# Altium project PPC_notebook_electrical_schematics_v0.7.PrjPcb (part 12 of 14)

## Sheet 29 Other Pwr 1.SchDoc
size 420 x 297 mm
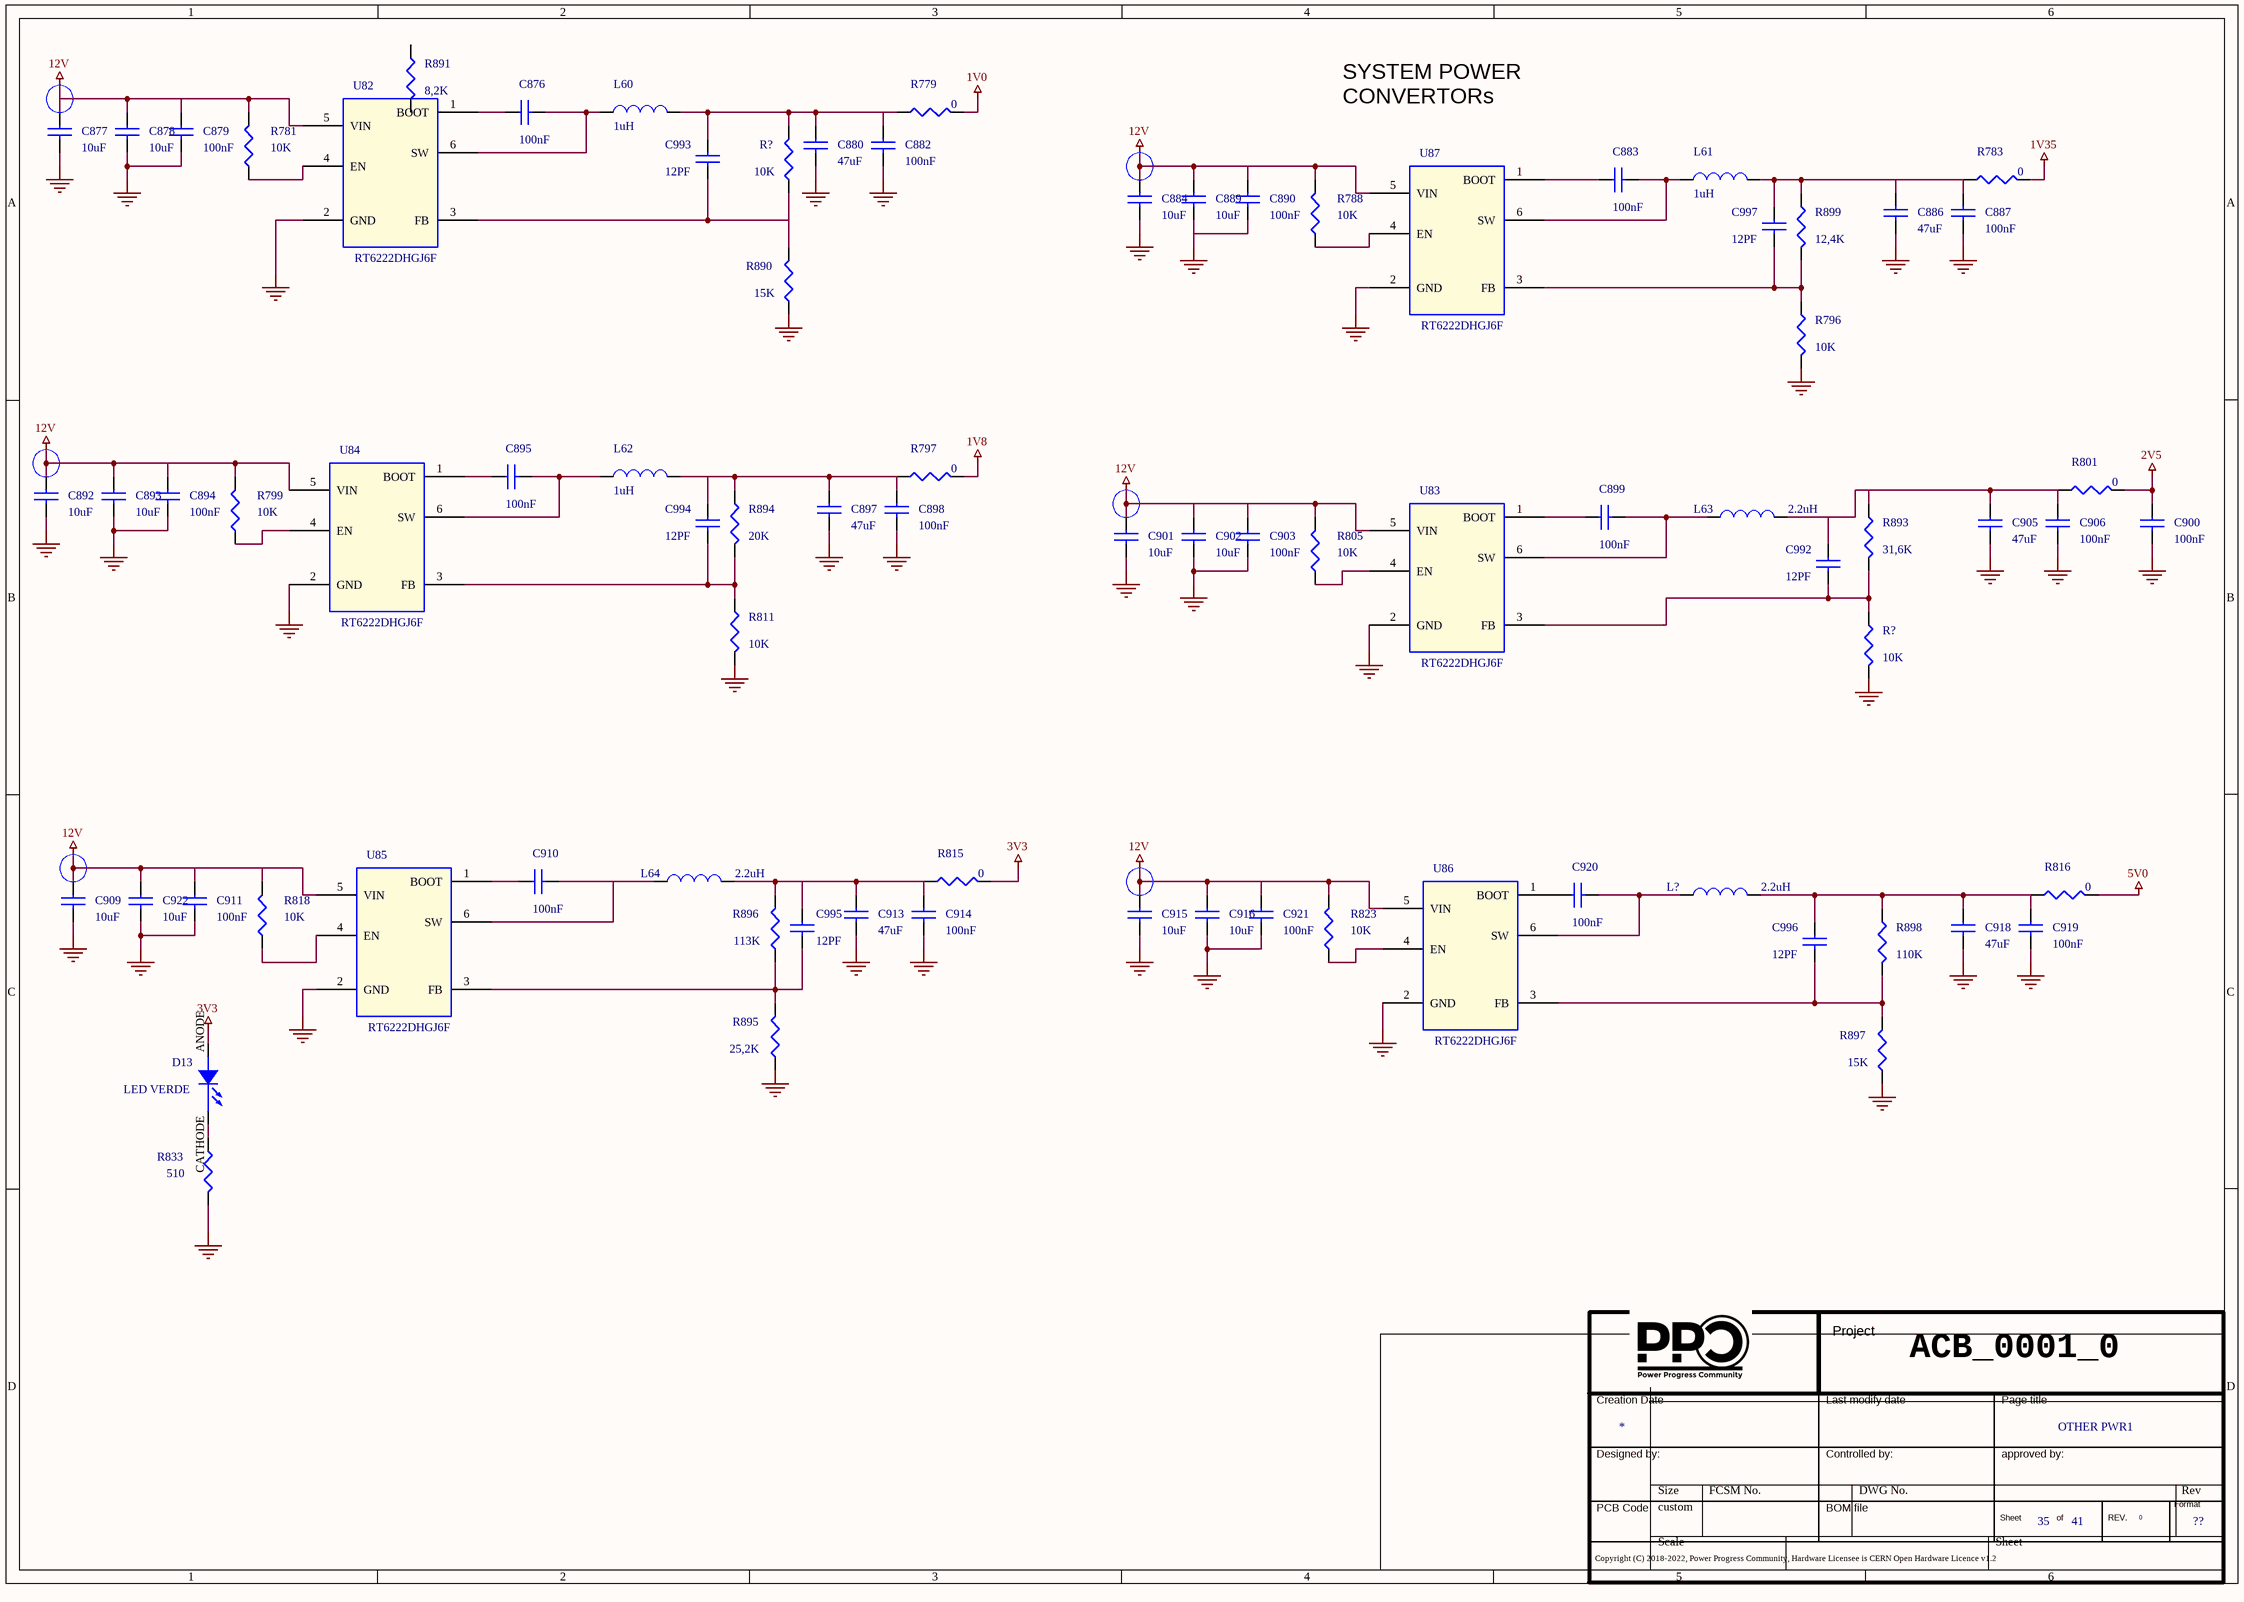
[diagram p61: 29 Other Pwr 1.SchDoc]

### Parts
(Parts that share a designator on the sheet are numbered #1, #2 ... from top to bottom, then left to right.)
*#38  Doc: OTHER PWR1  Page Count: 41  Page Number: 35  Page Size: ??  RevCode: 0  (hidden comment: Title_block_PPC)  (graphical)
C876  100nF  [SMD_0402]
C877  10uF  [SMD_0603]
C878  10uF  [SMD_0603]
C879  100nF  [SMD_0402]
C880  47uF  [SMD_0805]
C882  100nF  [SMD_0402]
C883  100nF  [SMD_0402]
C884  10uF  [SMD_0603]
C886  47uF  [SMD_0805]
C887  100nF  [SMD_0402]
C889  10uF  [SMD_0603]
C890  100nF  [SMD_0402]
C892  10uF  [SMD_0603]
C893  10uF  [SMD_0603]
C894  100nF  [SMD_0402]
C895  100nF  [SMD_0402]
C897  47uF  [SMD_0805]
C898  100nF  [SMD_0402]
C899  100nF  [SMD_0402]
C900  100nF  [SMD_0402]
C901  10uF  [SMD_0603]
C902  10uF  [SMD_0603]
C903  100nF  [SMD_0402]
C905  47uF  [SMD_0805]
C906  100nF  [SMD_0402]
C909  10uF  [SMD_0603]
C910  100nF  [SMD_0402]
C911  100nF  [SMD_0402]
C913  47uF  [SMD_0805]
C914  100nF  [SMD_0402]
C915  10uF  [SMD_0603]
C916  10uF  [SMD_0603]
C918  47uF  [SMD_0805]
C919  100nF  [SMD_0402]
C920  100nF  [SMD_0402]
C921  100nF  [SMD_0402]
C922  10uF  [SMD_0603]
C992  12PF  [SMD_0402]
C993  12PF  [SMD_0402]
C994  12PF  [SMD_0402]
C995  12PF  [SMD_0402]
C996  12PF  [SMD_0402]
C997  12PF  [SMD_0402]
D13  LED VERDE  [led_0603]
L60  1uH  [SMD]
L61  1uH  [SMD]
L62  1uH  [SMD]
L63  2.2uH  [SMD]
L64  2.2uH  [SMD]
L?  2.2uH  [SMD]
R779  0  [SMD_1206]
R781  10K  [SMD_0402]
R783  0  [SMD_1206]
R788  10K  [SMD_0402]
R796  10K  [SMD_0402]
R797  0  [SMD_1206]
R799  10K  [SMD_0402]
R801  0  [SMD_1206]
R805  10K  [SMD_0402]
R811  10K  [SMD_0402]
R815  0  [SMD_1206]
R816  0  [SMD_1206]
R818  10K  [SMD_0402]
R823  10K  [SMD_0402]
R833  510  [SMD_0402]
R890  15K  [SMD_0402]
R891  8,2K  [SMD_0402]
R893  31,6K  [SMD_0402]
R894  20K  [SMD_0402]
R895  25,2K  [SMD_0402]
R896  113K  [SMD_0402]
R897  15K  [SMD_0402]
R898  110K  [SMD_0402]
R899  12,4K  [SMD_0402]
R?#1  10K  [SMD_0402]
R?#2  10K  [SMD_0402]
U82  RT6222DHGJ6F
U83  RT6222DHGJ6F
U84  RT6222DHGJ6F
U85  RT6222DHGJ6F
U86  RT6222DHGJ6F
U87  RT6222DHGJ6F

### Nets
1V0: R779.2
1V8: R797.2
1V35: R783.2
2V5: C900.1 R801.2
3V3: D13.ANODE R815.2
5V0: R816.2
12V: C877.1 C878.1 C879.1 C884.1 C889.1 C890.1 C892.1 C893.1 C894.1 C901.1 C902.1 C903.1 C909.1 C911.1 C915.1 C916.1 C921.1 C922.1 R781.2 R788.2 R799.2 R805.2 R818.2 R823.2 U82.5(VIN) U83.5(VIN) U84.5(VIN) U85.5(VIN) U86.5(VIN) U87.5(VIN)
GND: C877.2 C878.2 C879.2 C880.2 C882.2 C884.2 C886.2 C887.2 C889.2 C890.2 C892.2 C893.2 C894.2 C897.2 C898.2 C900.2 C901.2 C902.2 C903.2 C905.2 C906.2 C909.2 C911.2 C913.2 C914.2 C915.2 C916.2 C918.2 C919.2 C921.2 C922.2 R796.2 R811.2 R833.1 R890.2 R895.2 R897.2 R?#2.2 U82.2(GND) U83.2(GND) U84.2(GND) U85.2(GND) U86.2(GND) U87.2(GND)
NetC876_1: C876.1 U82.1(BOOT)
NetC876_2: C876.2 L60.1 U82.6(SW)
NetC880_1: C880.1 C882.1 C993.1 L60.2 R779.1 R?#1.1
NetC883_1: C883.1 U87.1(BOOT)
NetC883_2: C883.2 L61.1 U87.6(SW)
NetC886_1: C886.1 C887.1 C997.1 L61.2 R783.1 R899.1
NetC895_1: C895.1 U84.1(BOOT)
NetC895_2: C895.2 L62.1 U84.6(SW)
NetC897_1: C897.1 C898.1 C994.1 L62.2 R797.1 R894.1
NetC899_1: C899.1 U83.1(BOOT)
NetC899_2: C899.2 L63.1 U83.6(SW)
NetC905_1: C905.1 C906.1 C992.1 L63.2 R801.1 R893.1
NetC910_1: C910.1 U85.1(BOOT)
NetC910_2: C910.2 L64.1 U85.6(SW)
NetC913_1: C913.1 C914.1 C995.1 L64.2 R815.1 R896.1
NetC918_1: C918.1 C919.1 C996.1 L?.2 R816.1 R898.1
NetC920_1: C920.1 U86.1(BOOT)
NetC920_2: C920.2 L?.1 U86.6(SW)
NetC992_2: C992.2 R893.2 R?#2.1 U83.3(FB)
NetC993_2: C993.2 R890.1 R?#1.2 U82.3(FB)
NetC994_2: C994.2 R811.1 R894.2 U84.3(FB)
NetC995_2: C995.2 R895.1 R896.2 U85.3(FB)
NetC996_2: C996.2 R897.1 R898.2 U86.3(FB)
NetC997_2: C997.2 R796.1 R899.2 U87.3(FB)
NetD13_CATHODE: D13.CATHODE R833.2
NetR781_1: R781.1 U82.4(EN)
NetR788_1: R788.1 U87.4(EN)
NetR799_1: R799.1 U84.4(EN)
NetR805_1: R805.1 U83.4(EN)
NetR818_1: R818.1 U85.4(EN)
NetR823_1: R823.1 U86.4(EN)

Not connected (* = marked no-connect by the designer): R891 1 2

### Notes on the sheet
- SYSTEM POWER
  CONVERTORs
- ACB_0001_0

### Library data of the parts
*#38 = Title_block_PPC: Title: T2080PCIe; Author: MICETEK; Page Create Date: March  8, 1995; Page Title: ?; Page Modify Date: *
C876 C879 C882 C890 C894 C895 C900 C903 C906 C910 C911 C920 C921 = CAP NP_Dup3: COND.CER. 100NF 50V 0402 X7R SMD; Manufacturer Part Number 1: CGA2B3X7R1H104M050BD; Manufacturer 1: TDK; Part Number: PASSIVE_24; RSM: RC0402; PCB Footprint: SMD_0402; Part Type: Capacitors\Ceramic\SMD\0402
C877 C878 C889 C892 C893 C901 C902 C909 C915 C916 C922 = CAP NP_Dup3: COND.CER.10uF 0603 25V SMD; Manufacturer Part Number 1: CL10A106MA8NRNC; Manufacturer 1: SAMSUNG; Part Number: PASSIVE_124; RSM: RC0603; Part Type: Capacitors\Ceramic\SMD\0603; PCB Footprint: SMD_0603
C880 C905 = CAP NP_Dup3: CAP CER 47UF 10V 20% X5R 0805; Manufacturer Part Number 1: JMK212BJ476MG-T; Manufacturer 1: Taiyo Yuden; Part Number: PASSIVE_244; RSM: RC0805; PCB Footprint: SMD_0805; Part Type: Capacitors\Ceramic\SMD\0805
C883 C887 C898 C899 C914 C919 = CAP NP_Dup3: COND.CER. 100NF 50V 0402 X7R SMD; Part Number: PASSIVE_24; Manufacturer 1: TDK; Manufacturer Part Number 1: CGA2B3X7R1H104M050BD; RSM: RC0402; PCB Footprint: SMD_0402; Part Type: Capacitors\Ceramic\SMD\0402
C884 = CAP NP_Dup3: COND.CER.10uF 0603 25V SMD; Part Number: PASSIVE_124; Manufacturer 1: SAMSUNG; Manufacturer Part Number 1: CL10A106MA8NRNC; RSM: RC0603; Part Type: Capacitors\Ceramic\SMD\0603; PCB Footprint: SMD_0603
C886 C897 C913 C918 = CAP NP_Dup3: CAP CER 47UF 10V 20% X5R 0805; Part Number: PASSIVE_244; Manufacturer 1: Taiyo Yuden; Manufacturer Part Number 1: JMK212BJ476MG-T; RSM: RC0805; PCB Footprint: SMD_0805; Part Type: Capacitors\Ceramic\SMD\0805
C992 C993 C996 C997 = CAP NP: COND.CER.12PF 50V 0402 NPO/COG SMD; Manufacturer Part Number 1: GRM1555C1H120JZ01D; Manufacturer 1: MURATA; Part Number: PASSIVE_36; RSM: RC0402; PCB Footprint: SMD_0402; Distributor 1: MURATA ELETTRONICA SPA; Part Type: Capacitors\Ceramic\SMD\0402
C994 C995 = CAP NP: COND.CER.12PF 50V 0402 NPO/COG SMD; Part Number: PASSIVE_36; Manufacturer 1: MURATA; Manufacturer Part Number 1: GRM1555C1H120JZ01D; RSM: RC0402; PCB Footprint: SMD_0402; Part Type: Capacitors\Ceramic\SMD\0402; Distributor 1: MURATA ELETTRONICA SPA
D13 = LED_1: LED CHIPLED VERDE 40mcd 570nm; Manufacturer Part Number 1: 598-8070-107F; Manufacturer 1: DIALIGHT; Part Number: DISCRETE_31; PCB Footprint: SMD_0603; RSM: LED0603-AK; Distributor 1: MOUSER(645-598-8070-107F); Part Type: Diodes\LED; TYPE: LED
L60-L62 = INDUCTOR_Dup1: FIXED IND 1UH 11A 16.5 Mohm SMD; Part Number: PASSIVE_1467; Manufacturer 1: Vishay; Manufacturer Part Number 1: IHLP2525CZER1R0M01; RSM: IND-VISHAY-IHLP2525; PCB Footprint: SMD; Part Type: Inductors\SMD\IHLP2525
L63 L64 = INDUCTOR_Dup1: FIXED IND 2.2UH 7A 16.5 Mohm SMD; Manufacturer Part Number 1: IHLP2525CZER2R2M1; Manufacturer 1: Vishay; Part Number: PASSIVE_513; RSM: IND-VISHAY-IHLP2525; PCB Footprint: SMD; Part Type: Inductors\SMD\IHLP2525
L? = INDUCTOR_Dup1: FIXED IND 2.2UH 7A 16.5 Mohm SMD; Part Number: PASSIVE_513; Manufacturer 1: VISHAY; Manufacturer Part Number 1: IHLP2525CZER2R2M1; PCB Footprint: SMD; Part Type: Inductors\SMD\IHLP2525
R779 R801 = R_Dup6: RESIS. 0R 1/4W 1206 SMD E96; Manufacturer Part Number 1: RC1206JR-070RL; Manufacturer 1: YAGEO; Part Number: PASSIVE_1266; RSM: RC1206; PCB Footprint: SMD_1206; Part Type: Resistors\Fixed\SMD\1206\5%
R781 R788 R796 R799 R805 R811 R818 R823 = R_Dup6: RESIS.CHIP 10K 1% 0402 SMD; Manufacturer 1: ROYAL OHM; Part Number: PASSIVE_584; RSM: RC0402; Manufacturer Part Number 1: RESIS.CHIP 10K 1% 0402 SMD; Part Type: Resistors\Fixed\SMD\0402\1%; PCB Footprint: SMD_0402
R783 R797 R815 R816 = R_Dup6: RESIS. 0R 1/4W 1206 SMD E96; Part Number: PASSIVE_1266; Manufacturer 1: YAGEO; Manufacturer Part Number 1: RC1206JR-070RL; RSM: RC1206; PCB Footprint: SMD_1206; Part Type: Resistors\Fixed\SMD\1206\5%
R833 = R_Dup6: RESIS.CHIP 510R 1% 0402 SMD; Part Number: PASSIVE_749; Manufacturer 1: ROYAL OHM; RSM: RC0402; PCB Footprint: SMD_0402; Part Type: Resistors\Fixed\SMD\0402\1%; Manufacturer Part Number 1: RESIS.CHIP 510R 1% 0402 SMD
R890 R897 = R: RESIS.CHIP 15K 1% 0402 SMD; Manufacturer 1: ROYAL OHM; Part Number: PASSIVE_614; PCB Footprint: SMD_0402; Distributor 1: CAMEL ELETTRONICA SRL  #; Manufacturer Part Number 1: RESIS.CHIP 15K 1% 0402 SMD; Part Type: Resistors\Fixed\SMD\0402\1%
R891 = R: RESIS. CHIP 8,2K 1% 0402 SMD; Manufacturer Part Number 1: RMC1/16SK8201FTH; Manufacturer 1: KAMAYA; Part Number: PASSIVE_786; RSM: RC0402; PCB Footprint: SMD_0402; Distributor 1: MODULI ELETTRONICI E COMPONENTI spa; Part Type: Resistors\Fixed\SMD\0402\1%
R893 = R: RESIS.CHIP 31K6 1% 0402 SMD; Part Number: PASSIVE_691; Manufacturer 1: ROYAL OHM; Manufacturer Part Number 1: RESIS.CHIP6K34 1% 0402 SMD; PCB Footprint: SMD_0402; Part Type: Resistors\Fixed\SMD\0402\1%; Distributor 1: CAMEL ELETTRONICA SRL  #
R894 = R: RESIS.CHIP 20K 1% 0402 SMD; Part Number: PASSIVE_641; Manufacturer 1: YAGEO; Manufacturer Part Number 1: RC0402FR-1320KL; PCB Footprint: SMD_0402; Part Type: Resistors\Fixed\SMD\0402\1%; Distributor 1: MOUSER(603-RC0402FR-1320KL)
R895 = R: RESIS.CHIP 25K2 1% 0402 SMD; Manufacturer 1: ROYAL OHM; Part Number: PASSIVE_657; PCB Footprint: SMD_0402; Distributor 1: CAMEL ELETTRONICA SRL  #; Manufacturer Part Number 1: RESIS.CHIP25K2 1% 0402 SMD; Part Type: Resistors\Fixed\SMD\0402\1%
R896 = R: RES 113K OHM 1/10W 1% 0402 SMD; Manufacturer Part Number 1: ERJ-2RKF1133X; Manufacturer 1: PANASONIC; Part Number: PASSIVE_1395; PCB Footprint: SMD_0402; Distributor 1: DIGIKEY(P113KLTR-ND); Part Type: Resistors\Fixed\SMD\0402\1%
R898 = R: RESIS.CHIP 110K 1% 0402 SMD; Manufacturer 1: ROYAL OHM; Part Number: PASSIVE_588; PCB Footprint: SMD_0402; Distributor 1: CAMEL ELETTRONICA SRL  #; Manufacturer Part Number 1: RESIS.CHIP 110K 1% 0402 SMD; Part Type: Resistors\Fixed\SMD\0402\1%
R899 = R: RESIS.CHIP 12,4K 1% 0402 SMD; Part Number: PASSIVE_591; Manufacturer 1: ROYAL OHM; PCB Footprint: SMD_0402; Part Type: Resistors\Fixed\SMD\0402\1%; Manufacturer Part Number 1: RESIS.CHIP 12,4K 1% 0402 SMD; Distributor 1: CAMEL ELETTRONICA SRL  #
R?#1 = R_Dup6: RESIS.CHIP 10K 1% 0402 SMD; Part Number: PASSIVE_584; Manufacturer 1: ROYAL OHM; PCB Footprint: SMD_0402; Part Type: Resistors\Fixed\SMD\0402\1%; Manufacturer Part Number 1: RESIS.CHIP 10K 1% 0402 SMD
R?#2 = R_Dup6: RESIS.CHIP 10K 1% 0402 SMD; Manufacturer 1: ROYAL OHM; Part Number: PASSIVE_584; PCB Footprint: SMD_0402; Manufacturer Part Number 1: RESIS.CHIP 10K 1% 0402 SMD; Part Type: Resistors\Fixed\SMD\0402\1%

## Sheet 30A Other Pwr 2.SchDoc
size 297 x 209 mm
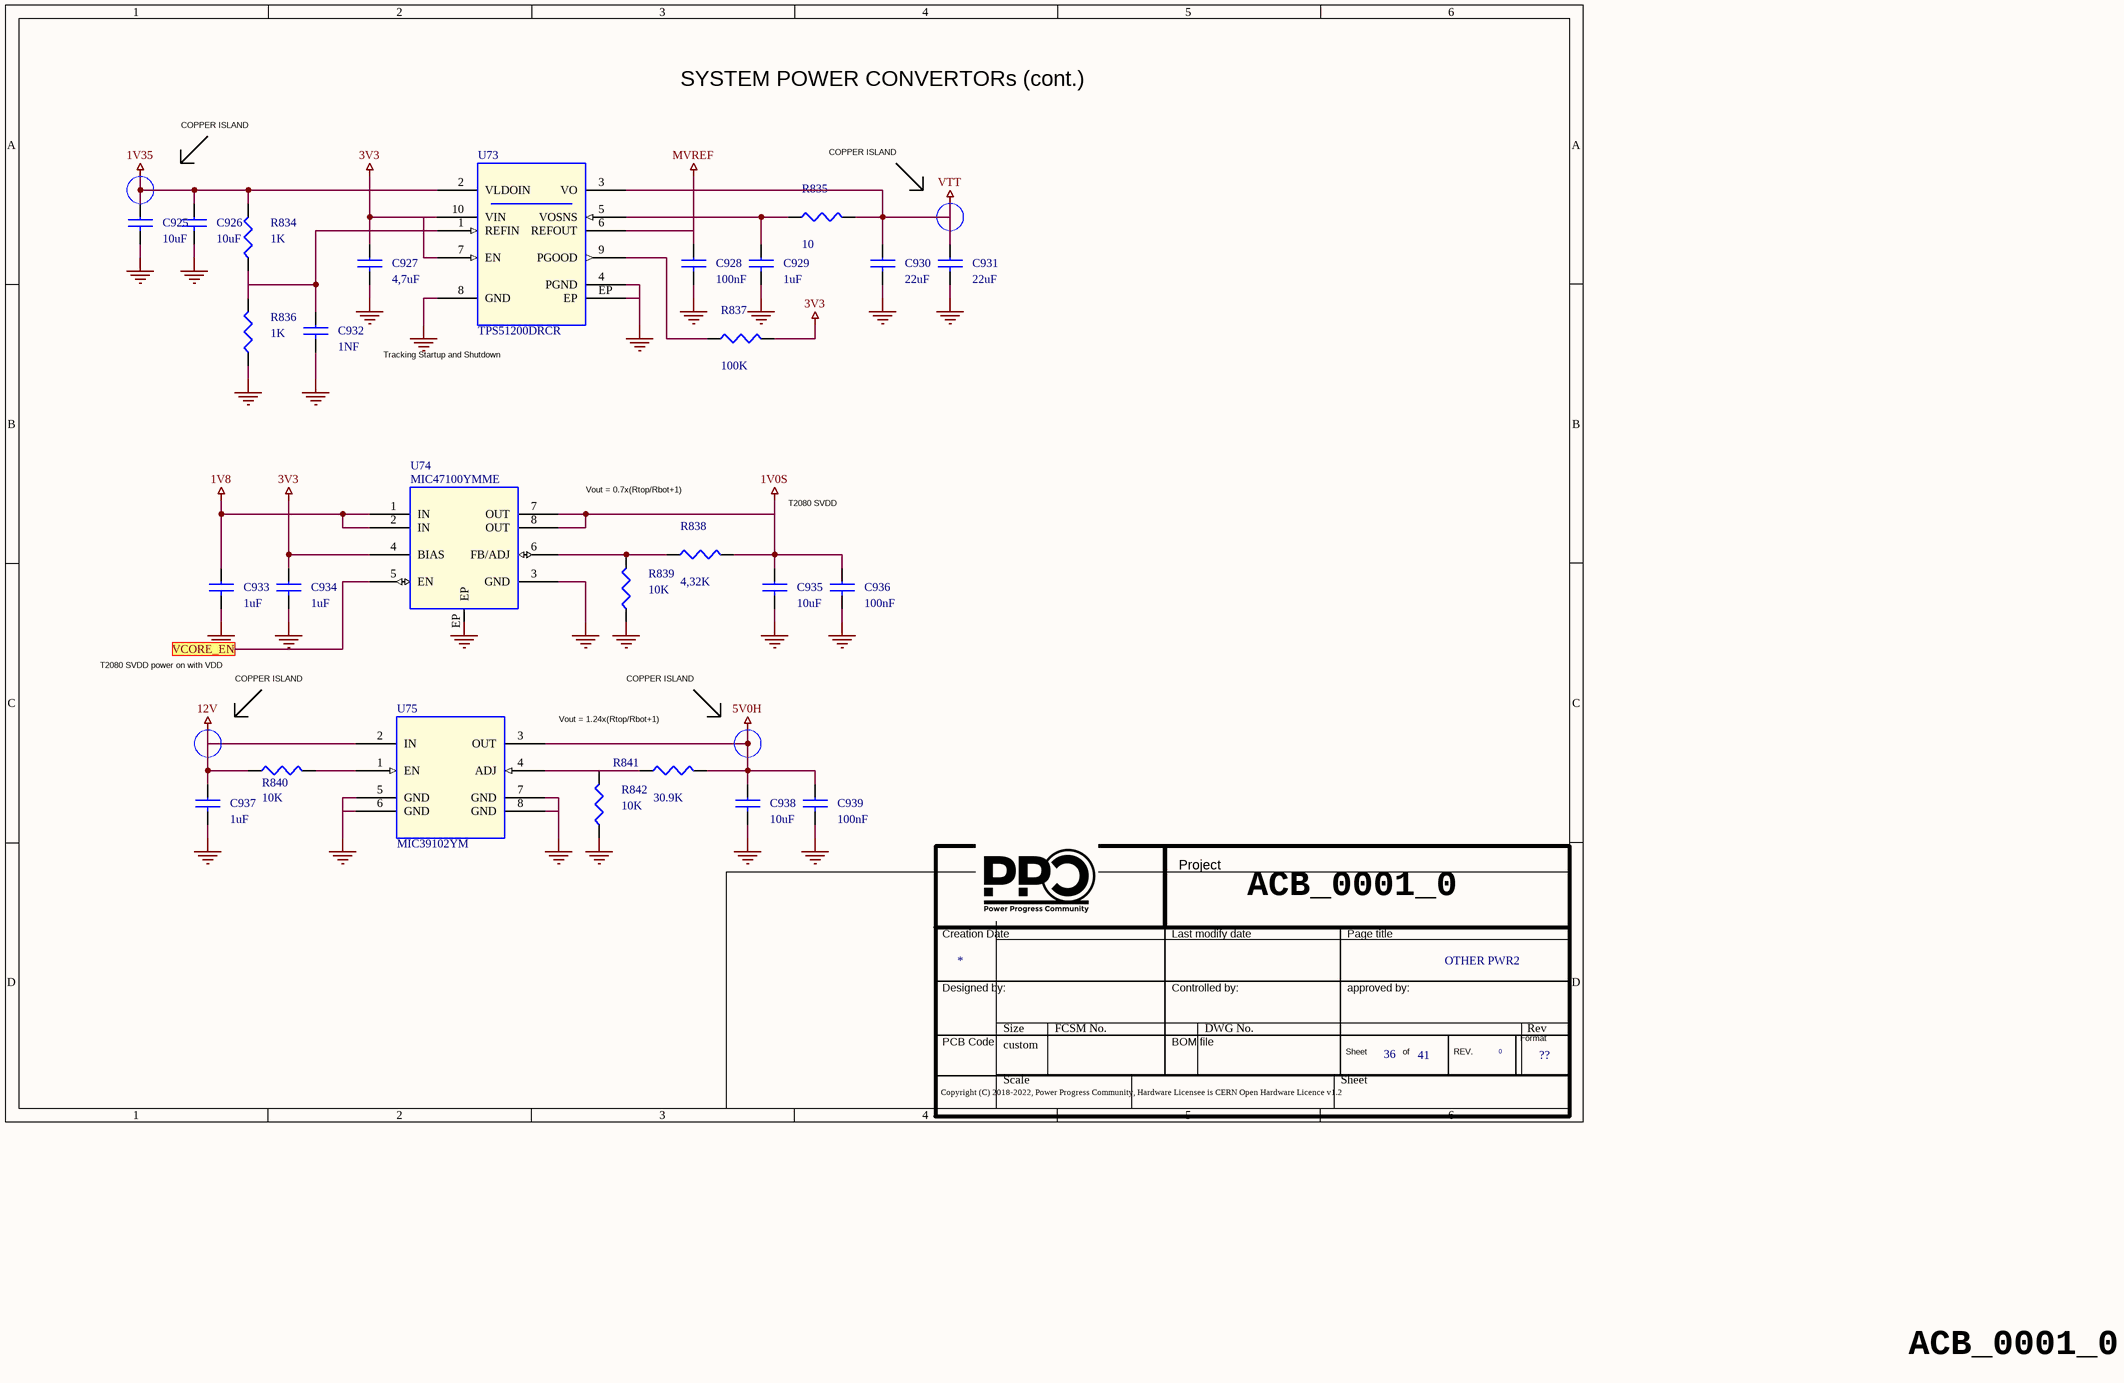
[diagram p62: 30A Other Pwr 2.SchDoc]

### Parts
(Parts that share a designator on the sheet are numbered #1, #2 ... from top to bottom, then left to right.)
*#39  Doc: OTHER PWR2  Page Count: 41  Page Number: 36  Page Size: ??  RevCode: 0  (hidden comment: Title_block_PPC)  (graphical)
C925  10uF  [SMD_0603]
C926  10uF  [SMD_0603]
C927  4,7uF  [SMD_0603]
C928  100nF  [SMD_0402]
C929  1uF  [SMD_0402]
C930  22uF  [SMD_0805]
C931  22uF  [SMD_0805]
C932  1NF  [SMD_0402]
C933  1uF  [SMD_0402]
C934  1uF  [SMD_0402]
C935  10uF  [SMD_0603]
C936  100nF  [SMD_0402]
C937  1uF  [SMD_0402]
C938  10uF  [SMD_0603]
C939  100nF  [SMD_0402]
R834  1K  [SMD_0402]
R835  10  [SMD_0402]
R836  1K  [SMD_0402]
R837  100K  [SMD_0402]
R838  4,32K  [SMD_0402]
R839  10K  [SMD_0402]
R840  10K  [SMD_0402]
R841  30.9K  [SMD_0402]
R842  10K  [SMD_0402]
U73  TPS51200DRCR  [QFN-10]
U74  MIC47100YMME  [msop_8]
U75  MIC39102YM  [SOIC-8]

### Ports
VCORE_EN

### Nets
1V0S: C935.1 C936.1 R838.2 U74.7(OUT) U74.8(OUT)
1V8: C933.1 U74.1(IN) U74.2(IN)
1V35: C925.1 C926.1 R834.2 U73.2(VLDOIN)
3V3: C927.1 C934.1 R837.2 U73.7(EN) U73.10(VIN) U74.4(BIAS)
5V0H: C938.1 C939.1 R841.2 U75.3(OUT)
12V: C937.1 R840.1 U75.2(IN)
GND: C925.2 C926.2 C927.2 C928.2 C929.2 C930.2 C931.2 C932.2 C933.2 C934.2 C935.2 C936.2 C937.2 C938.2 C939.2 R836.1 R839.1 R842.1 U73.4(PGND) U73.8(GND) U73.EP U74.3(GND) U74.EP U75.5(GND) U75.6(GND) U75.7(GND) U75.8(GND)
MVREF: C928.1 U73.6(REFOUT)
VTT: C930.1 C931.1 R835.2 U73.3(VO)
NetC929_1: C929.1 R835.1 U73.5(VOSNS)
NetC932_1: C932.1 R834.1 R836.2 U73.1(REFIN)
NetR292_2: U74.5(EN) ; port VCORE_EN
NetR837_1: R837.1 U73.9(PGOOD)
NetR838_1: R838.1 R839.2 U74.6(FB/ADJ)
NetR840_2: R840.2 U75.1(EN)
NetR841_1: R841.1 R842.2 U75.4(ADJ)

### Notes on the sheet
- COPPER ISLAND
- SYSTEM POWER CONVERTORs (cont.)
- Tracking Startup and Shutdown
- Vout = 0.7x(Rtop/Rbot+1)
- T2080 SVDD
- T2080 SVDD power on with VDD
- Vout = 1.24x(Rtop/Rbot+1)
- ACB_0001_0

### Library data of the parts
*#39 = Title_block_PPC: Title: T2080PCIe; Author: MICETEK; Page Create Date: March  8, 1995; Page Title: ?; Page Modify Date: *
C925 C926 C935 C938 = CAP NP_Dup3: as C877 on sheet 29 Other Pwr 1; PCB Footprint: SMD_0603; Part Type: Capacitors\Ceramic\SMD\0603
C927 = CAP NP_Dup3: COND.CER.4,7uF 16V X5R 0603 SMD; Part Number: PASSIVE_1405; Manufacturer 1: SAMSUNG; Manufacturer Part Number 1: CL10A475KO8NNNC; RSM: RC0603; Part Type: Capacitors\Ceramic\SMD\0603; PCB Footprint: SMD_0603
C928 C936 = CAP NP_Dup3: as C883 on sheet 29 Other Pwr 1; Part Type: Capacitors\Ceramic\SMD\0402; PCB Footprint: SMD_0402
C929 C933 C934 C937 = CAP NP_Dup3: CAP CER 1UF 25V X6S 0402; Manufacturer Part Number 1: GRM155C81E105KE11D; Manufacturer 1: Murata; Part Number: PASSIVE_1446; RSM: RC0402; PCB Footprint: SMD_0402; Part Type: Capacitors\Ceramic\SMD\0402
C930 C931 = CAP NP_Dup3: 22UF 35V 20% 0805; Manufacturer Part Number 1: C2012X5R1V226M125AC; Manufacturer 1: TDK; Part Number: PASSIVE_224; RSM: RC0805; PCB Footprint: SMD_0805; Part Type: Capacitors\Ceramic\SMD\0805
C932 = CAP NP_Dup3: COND.CER. 1NF 50V 0402 X7R SMD; Part Number: PASSIVE_47; Manufacturer 1: Murata; Manufacturer Part Number 1: GRM15XR71H102KA86D; RSM: RC0402; Part Type: Capacitors\Ceramic\SMD\0402; PCB Footprint: SMD_0402
C939 = CAP NP_Dup3: as C876 on sheet 29 Other Pwr 1; PCB Footprint: SMD_0402; Part Type: Capacitors\Ceramic\SMD\0402
R834 R836 = R_Dup6: RESIS.CHIP 1K 1% 0402 SMD; Part Number: PASSIVE_628; Manufacturer 1: ROYAL OHM; RSM: RC0402; PCB Footprint: SMD_0402; Part Type: Resistors\Fixed\SMD\0402\1%; Manufacturer Part Number 1: RESIS.CHIP 1K 1% 0402 SMD
R835 = R_Dup6: RESIS.CHIP 10R 5% 0402 SMD; Manufacturer 1: ROYAL OHM; Part Number: PASSIVE_811; RSM: RC0402; PCB Footprint: SMD_0402; Manufacturer Part Number 1: RESIS.CHIP 10R 5% 0402 SMD; Part Type: Resistors\Fixed\SMD\0402\5%
R837 = R_Dup6: RESIS.CHIP 100K 5% 0402 SMD; Part Number: PASSIVE_813; Manufacturer 1: ROYAL OHM; RSM: RC0402; Part Type: Resistors\Fixed\SMD\0402\5%; Manufacturer Part Number 1: RESIS.CHIP 100K 5% 0402 SMD; PCB Footprint: SMD_0402
R838 = R_Dup6: RESIS.CHIP 4,32K 0402 1% SMD; Manufacturer Part Number 1: ERJ-2RKF4321X; Manufacturer 1: PANASONIC; Part Number: PASSIVE_716; RSM: RC0402; PCB Footprint: SMD_0402; Part Type: Resistors\Fixed\SMD\0402\1%
R839 R842 = R_Dup6: RESIS.CHIP 10K 1% 0402 SMD; Part Number: PASSIVE_584; Manufacturer 1: ROYAL OHM; RSM: RC0402; Part Type: Resistors\Fixed\SMD\0402\1%; Manufacturer Part Number 1: RESIS.CHIP 10K 1% 0402 SMD; PCB Footprint: SMD_0402
R840 = R_Dup6: as R781 on sheet 29 Other Pwr 1; Manufacturer Part Number 1: RESIS.CHIP 10K 1% 0402 SMD; Part Type: Resistors\Fixed\SMD\0402\1%; PCB Footprint: SMD_0402
R841 = R_Dup6: RESIS.CHIP 30.9K 1% 0402 SMD; Manufacturer Part Number 1: ERJ-1GNF3092C; Manufacturer 1: bourns; Part Number: PASSIVE_1452; RSM: RC0402; PCB Footprint: SMD_0402; Part Type: Resistors\Fixed\SMD\0402\1%
U73 = TPS51200_1: IC CONV DDR DDR2 DDR3 10SON; Manufacturer 1: TEXAS; Part Number: LINEAR_222; MPN: TPS51200DRCT; Vendor: TI; RSM: VSON-10-3_1x3_1; PCB Footprint: SON10; Distributor 1: DIGIKEY (296-26978-1-ND); Manufacturer Part Number 1: TPS51200DRCR; Part Type: Regulators\Switching; TYPE: IC
U74 = MIC47100-MSOP8_1: LDO 1A High Speed, Low Vin LDO; Manufacturer 1: MICROCHIP; Part Number: LINEAR_328; MPN: MIC49150YMM; PCB Footprint: MSOP8; Vendor: Micrel; RSM: MSOP-8-EP; Distributor 1: MOUSER(998-MIC47100YMME); Manufacturer Part Number 1: MIC47100YMME; Part Type: Regulators\LDO; TYPE: IC
U75 = MIC39102-SOIC: LDO 1.0A 1.0% Fixed Voltage LDO; Manufacturer 1: MICROCHIP; Part Number: LINEAR_329; PCB Footprint: SOIC8; Vendor: Micrel; RSM: SO-8; Distributor 1: MOUSER(998-MIC39102YM); Manufacturer Part Number 1: MIC39102YM; Part Type: Regulators\LDO; TYPE: IC; MPN: MIC39102YM

## Sheet 30B Main Power.SchDoc
size 420 x 297 mm
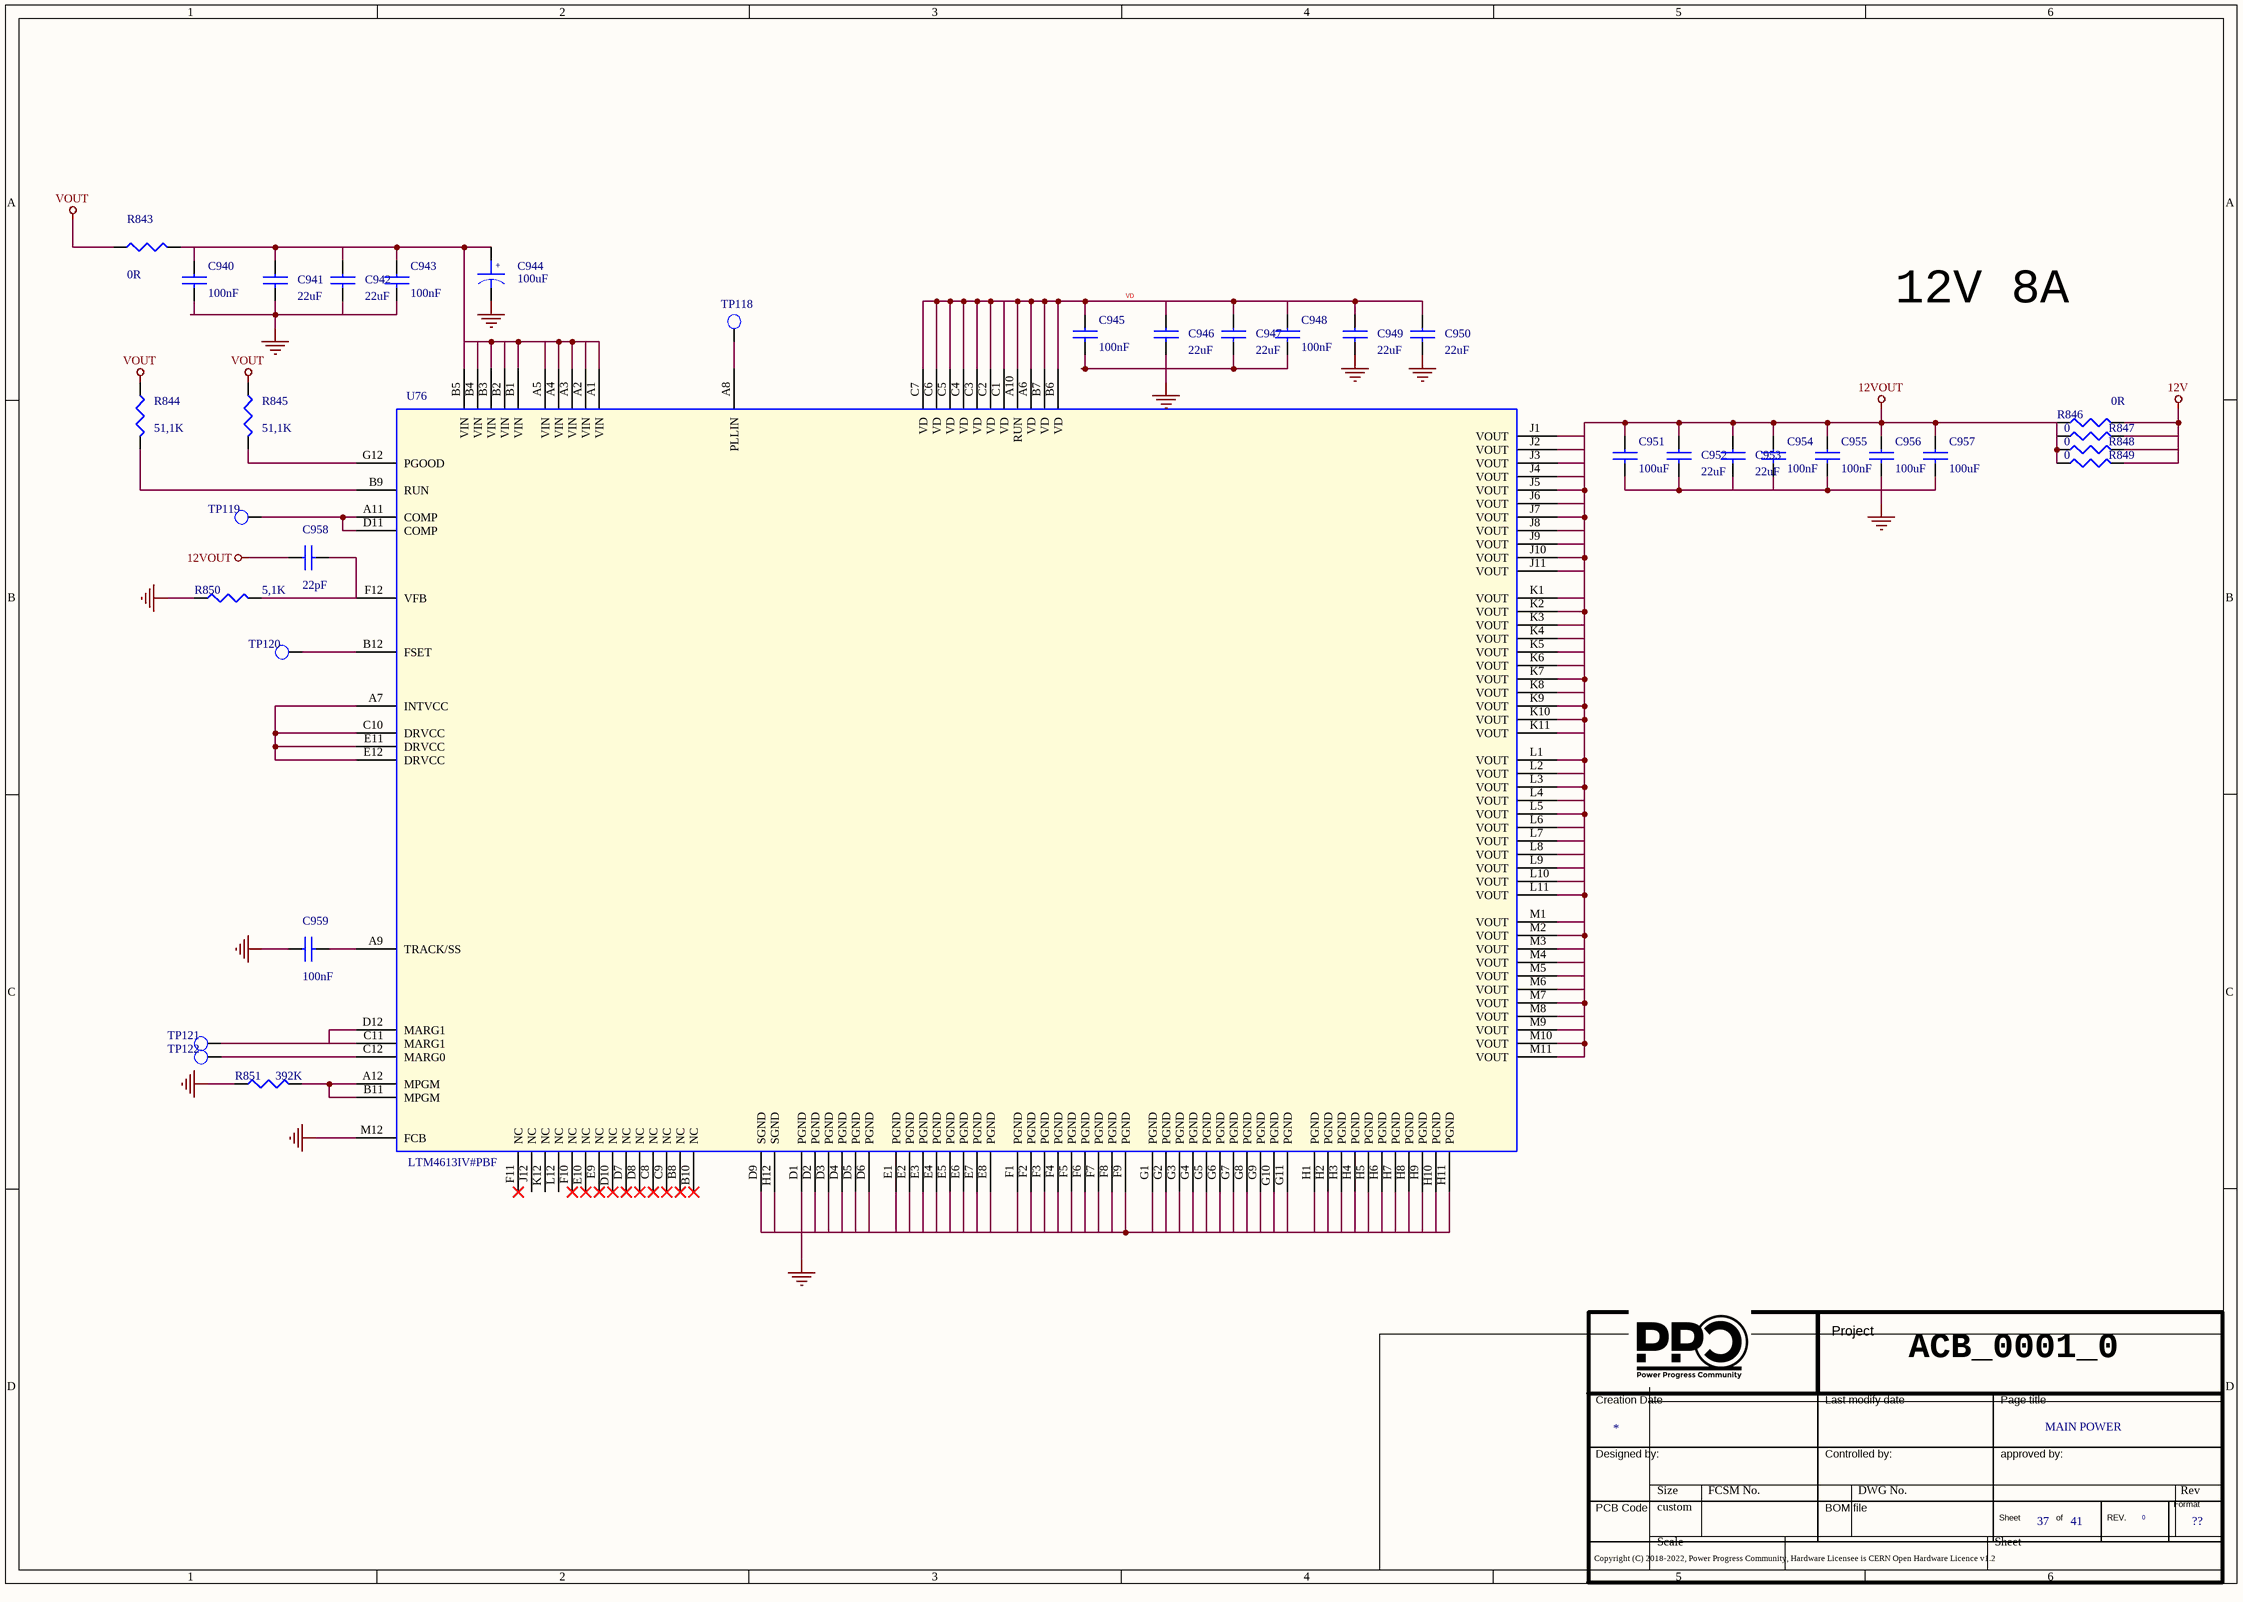
[diagram p63: 30B Main Power.SchDoc]

### Parts
(Parts that share a designator on the sheet are numbered #1, #2 ... from top to bottom, then left to right.)
*#40  Doc: MAIN POWER  Page Count: 41  Page Number: 37  Page Size: ??  RevCode: 0  (hidden comment: Title_block_PPC)  (graphical)
C940  100nF  [SMD_0402]
C941  22uF  [SMD_0805]
C942  22uF  [SMD_0805]
C943  100nF  [SMD_0402]
C944  100uF  [SMD_6.3X6.3x6.1]
C945  100nF  [SMD_0402]
C946  22uF  [SMD_0805]
C947  22uF  [SMD_0805]
C948  100nF  [SMD_0402]
C949  22uF  [SMD_0805]
C950  22uF  [SMD_0805]
C951  100uF  [SMD_1210]
C952  22uF  [SMD_0805]
C953  22uF  [SMD_0805]
C954  100nF  [SMD_0402]
C955  100nF  [SMD_0402]
C956  100uF  [SMD_1210]
C957  100uF  [SMD_1210]
C958  22pF  [SMD_0402]
C959  100nF  [SMD_0402]
R843  0R  [SMD_2512]
R844  51,1K  [SMD_0402]
R845  51,1K  [SMD_0402]
R846  0R  [SMD_2512]
R847  0  [SMD_1206]
R848  0  [SMD_1206]
R849  0  [SMD_1206]
R850  5,1K  [SMD_0402]
R851  392K  [SMD_0402]
TP118  TEST POINT  [PCB]  (value not drawn)
TP119  TEST POINT  [PCB]  (value not drawn)
TP120  TEST POINT  [PCB]  (value not drawn)
TP121  TEST POINT  [PCB]  (value not drawn)
TP122  TEST POINT  [PCB]  (value not drawn)
U76  LTM4613IV#PBF  [LGA-133]

### Nets
12V: R846.2 R847.1 R848.1 R849.1
12VOUT: C951.1 C952.1 C953.1 C954.1 C955.1 C956.1 C957.1 C958.1 R846.1 R847.2 R848.2 R849.2 U76.J1(VOUT) U76.J2(VOUT) U76.J3(VOUT) U76.J4(VOUT) U76.J5(VOUT) U76.J6(VOUT) U76.J7(VOUT) U76.J8(VOUT) U76.J9(VOUT) U76.J10(VOUT) U76.J11(VOUT) U76.K1(VOUT) U76.K2(VOUT) U76.K3(VOUT) U76.K4(VOUT) U76.K5(VOUT) U76.K6(VOUT) U76.K7(VOUT) U76.K8(VOUT) U76.K9(VOUT) U76.K10(VOUT) U76.K11(VOUT) U76.L1(VOUT) U76.L2(VOUT) U76.L3(VOUT) U76.L4(VOUT) U76.L5(VOUT) U76.L6(VOUT) U76.L7(VOUT) U76.L8(VOUT) U76.L9(VOUT) U76.L10(VOUT) U76.L11(VOUT) U76.M1(VOUT) U76.M2(VOUT) U76.M3(VOUT) U76.M4(VOUT) U76.M5(VOUT) U76.M6(VOUT) U76.M7(VOUT) U76.M8(VOUT) U76.M9(VOUT) U76.M10(VOUT) U76.M11(VOUT)
GND: C940.2 C941.2 C942.2 C943.2 C944.2 C945.2 C946.2 C947.2 C948.2 C949.2 C950.2 C956.2 C959.1 R850.1 R851.1 U76.D1(PGND) U76.D2(PGND) U76.D3(PGND) U76.D4(PGND) U76.D5(PGND) U76.D6(PGND) U76.D9(SGND) U76.E1(PGND) U76.E2(PGND) U76.E3(PGND) U76.E4(PGND) U76.E5(PGND) U76.E6(PGND) U76.E7(PGND) U76.E8(PGND) U76.F1(PGND) U76.F2(PGND) U76.F3(PGND) U76.F4(PGND) U76.F5(PGND) U76.F6(PGND) U76.F7(PGND) U76.F8(PGND) U76.F9(PGND) U76.G1(PGND) U76.G2(PGND) U76.G3(PGND) U76.G4(PGND) U76.G5(PGND) U76.G6(PGND) U76.G7(PGND) U76.G8(PGND) U76.G9(PGND) U76.G10(PGND) U76.G11(PGND) U76.H1(PGND) U76.H2(PGND) U76.H3(PGND) U76.H4(PGND) U76.H5(PGND) U76.H6(PGND) U76.H7(PGND) U76.H8(PGND) U76.H9(PGND) U76.H10(PGND) U76.H11(PGND) U76.H12(SGND) U76.M12(FCB)
VOUT: R843.1 R844.1 R845.1
VD: C945.1 C946.1 C947.1 C948.1 C949.1 C950.1 U76.A6(VD) U76.A10(RUN) U76.B6(VD) U76.B7(VD) U76.C1(VD) U76.C2(VD) U76.C3(VD) U76.C4(VD) U76.C5(VD) U76.C6(VD) U76.C7(VD)
NetC940_1: C940.1 C941.1 C942.1 C943.1 C944.1 R843.2 U76.A1(VIN) U76.A2(VIN) U76.A3(VIN) U76.A4(VIN) U76.A5(VIN) U76.B1(VIN) U76.B2(VIN) U76.B3(VIN) U76.B4(VIN) U76.B5(VIN)
NetC951_2: C951.2 C952.2 C953.2 C954.2 C955.2 C957.2
NetC958_2: C958.2 R850.2 U76.F12(VFB)
NetC959_2: C959.2 U76.A9(TRACK/SS)
NetR844_2: R844.2 U76.B9(RUN)
NetR845_2: R845.2 U76.G12(PGOOD)
NetR851_2: R851.2 U76.A12(MPGM) U76.B11(MPGM)
NetTP118_1: TP118.1(TP) U76.A8(PLLIN)
NetTP119_1: TP119.1(TP) U76.A11(COMP) U76.D11(COMP)
NetTP120_1: TP120.1(TP) U76.B12(FSET)
NetTP121_1: TP121.1(TP) U76.C11(MARG1) U76.D12(MARG1)
NetTP122_1: TP122.1(TP) U76.C12(MARG0)
NetU76_A7: U76.A7(INTVCC) U76.C10(DRVCC) U76.E11(DRVCC) U76.E12(DRVCC)

Not connected (* = marked no-connect by the designer): U76 B8(NC)* B10(NC)* C8(NC)* C9(NC)* D7(NC)* D8(NC)* D10(NC)* E9(NC)* E10(NC)* F10(NC)* F11(NC)* J12(NC) K12(NC) L12(NC)

### Notes on the sheet
- 12V 8A
- ACB_0001_0
- (in symbol CAP POL) +

### Library data of the parts
*#40 = Title_block_PPC: Title: PORTATILE ACUBE; Author: MICETEK; Page Create Date: March  8, 1995; Page Title: ?; Page Modify Date: *
C940 C943 C945 C948 = CAP NP_Dup10: COND.CER. 100NF 50V 0402 X7R SMD; Manufacturer Part Number 1: CGA2B3X7R1H104M050BD; Manufacturer 1: TDK; Part Number: PASSIVE_24; RSM: RC0402; PCB Footprint: SMD_0402; Distributor 1: DIGKEY (445-9694-2-ND); Part Type: Capacitors\Ceramic\SMD\0402
C941 C942 C946 C947 C949 C950 C952 C953 = CAP NP_Dup3: 22UF 35V 20% 0805; Part Number: PASSIVE_224; Manufacturer 1: TDK; Manufacturer Part Number 1: C2012X5R1V226M125AC; RSM: RC0805; Part Type: Capacitors\Ceramic\SMD\0805; PCB Footprint: SMD_0805
C944 = CAP POL: CAP ALUM 100UF 35V 20% SMD; Part Number: PASSIVE_1410; Manufacturer 1: PANASONIC; Manufacturer Part Number 1: EEE-FT1V101AP; RSM: CE-6_3X6_3; PCB Footprint: SMD_6.3X6.3x6.1; Part Type: Capacitors\Aluminium\SMD
C951 = CAP NP_Dup10: CAP CER 100UF 16V 20% X5R 1210; Part Number: PASSIVE_264; Manufacturer 1: Taiyo Yuden; Manufacturer Part Number 1: EMK325ABJ107MM-T; RSM: RC1210; PCB Footprint: SMD_1210; Part Type: Capacitors\Ceramic\SMD\1210; Distributor 1: DIGIKEY (587-3152-2-ND)
C954 C955 = CAP NP_Dup10: COND.CER. 100NF 50V 0402 X7R SMD; Part Number: PASSIVE_24; Manufacturer 1: TDK; Manufacturer Part Number 1: CGA2B3X7R1H104M050BD; RSM: RC0402; PCB Footprint: SMD_0402; Part Type: Capacitors\Ceramic\SMD\0402; Distributor 1: DIGKEY (445-9694-2-ND)
C956 C957 = CAP NP_Dup3: CAP CER 100UF 16V 20% X5R 1210; Manufacturer Part Number 1: EMK325ABJ107MM-T; Manufacturer 1: Taiyo Yuden; Part Number: PASSIVE_264; RSM: RC1210; PCB Footprint: SMD_1210; Part Type: Capacitors\Ceramic\SMD\1210
C958 = CAP NP_Dup3: COND.CER. 22PF 50V 0402 NPO 5% SMD; Manufacturer Part Number 1: GRM1555C1H220JZ01; Manufacturer 1: Murata; Part Number: PASSIVE_65; RSM: RC0402; PCB Footprint: SMD_0402; Part Type: Capacitors\Ceramic\SMD\0402
C959 = CAP NP_Dup3: as C876 on sheet 29 Other Pwr 1; PCB Footprint: SMD_0402; Part Type: Capacitors\Ceramic\SMD\0402
R843 R846 = R_Dup9: Thick Film Resistors 0OHM 1WATT 5%; Manufacturer Part Number 1: CR2512-J/-000ELF; Manufacturer 1: bourns; Part Number: PASSIVE_1318; RSM: RC2512; PCB Footprint: SMD_2512; Distributor 1: MOUSER(652-CR2512-J/-000ELF); Part Type: Resistors\Fixed\SMD\2512\1%
R844 R845 = R_Dup6: RESIS.CHIP 51K1 1% 0402 SMD; Part Number: PASSIVE_748; Manufacturer 1: ROYAL OHM; Manufacturer Part Number 1: CAMEL ELETTRONICA SRL  #; RSM: RC0402; PCB Footprint: SMD_0402; Part Type: Resistors\Fixed\SMD\0402\1%
R847-R849 = R_Dup6: RESIS. 0R 1/4W 1206 SMD E96; Manufacturer Part Number 1: CR32000ZL; Manufacturer 1: ASJ; Part Number: PASSIVE_1266; RSM: RC1206; PCB Footprint: SMD_1206; Part Type: Resistors\Fixed\SMD\1206\5%
R850 = R_Dup6: RES SMD 5.1K OHM 1% 1/16W 0402; Part Number: PASSIVE_742; Manufacturer 1: YAGEO; Manufacturer Part Number 1: RC0402FR-075K1L; RSM: RC0402; PCB Footprint: SMD_0402; Part Type: Resistors\Fixed\SMD\0402\1%
R851 = R_Dup6: RES 392K OHM 1/10W 1% 0402 SMD; Manufacturer Part Number 1: CRCW0402392KFKED; Manufacturer 1: Vishay; Part Number: PASSIVE_713; RSM: RC0402; PCB Footprint: SMD_0402; Part Type: Resistors\Fixed\SMD\0402\1%
TP118-TP122 = T POINT R: TEST POINT SU PCB; Part Number: CONNECTORS_542; RSM: AE-TESTPOINT; PCB Footprint: PCB; Part Type: Tpoint
U76 = LTM4613: Ultralow EMI, 36V, 8A Step-down Module; Manufacturer 1: ANALOG; Part Number: LINEAR_324; RSM: LGA-133-15X15; Distributor 1: MOUSER(584-LTM4613IV#PBF); Manufacturer Part Number 1: LTM4613IV#PBF; Part Type: Regulators\MODULE; PCB Footprint: LGA-133

## Sheet 30C_battery_Charger.SchDoc
size 508 x 355 mm
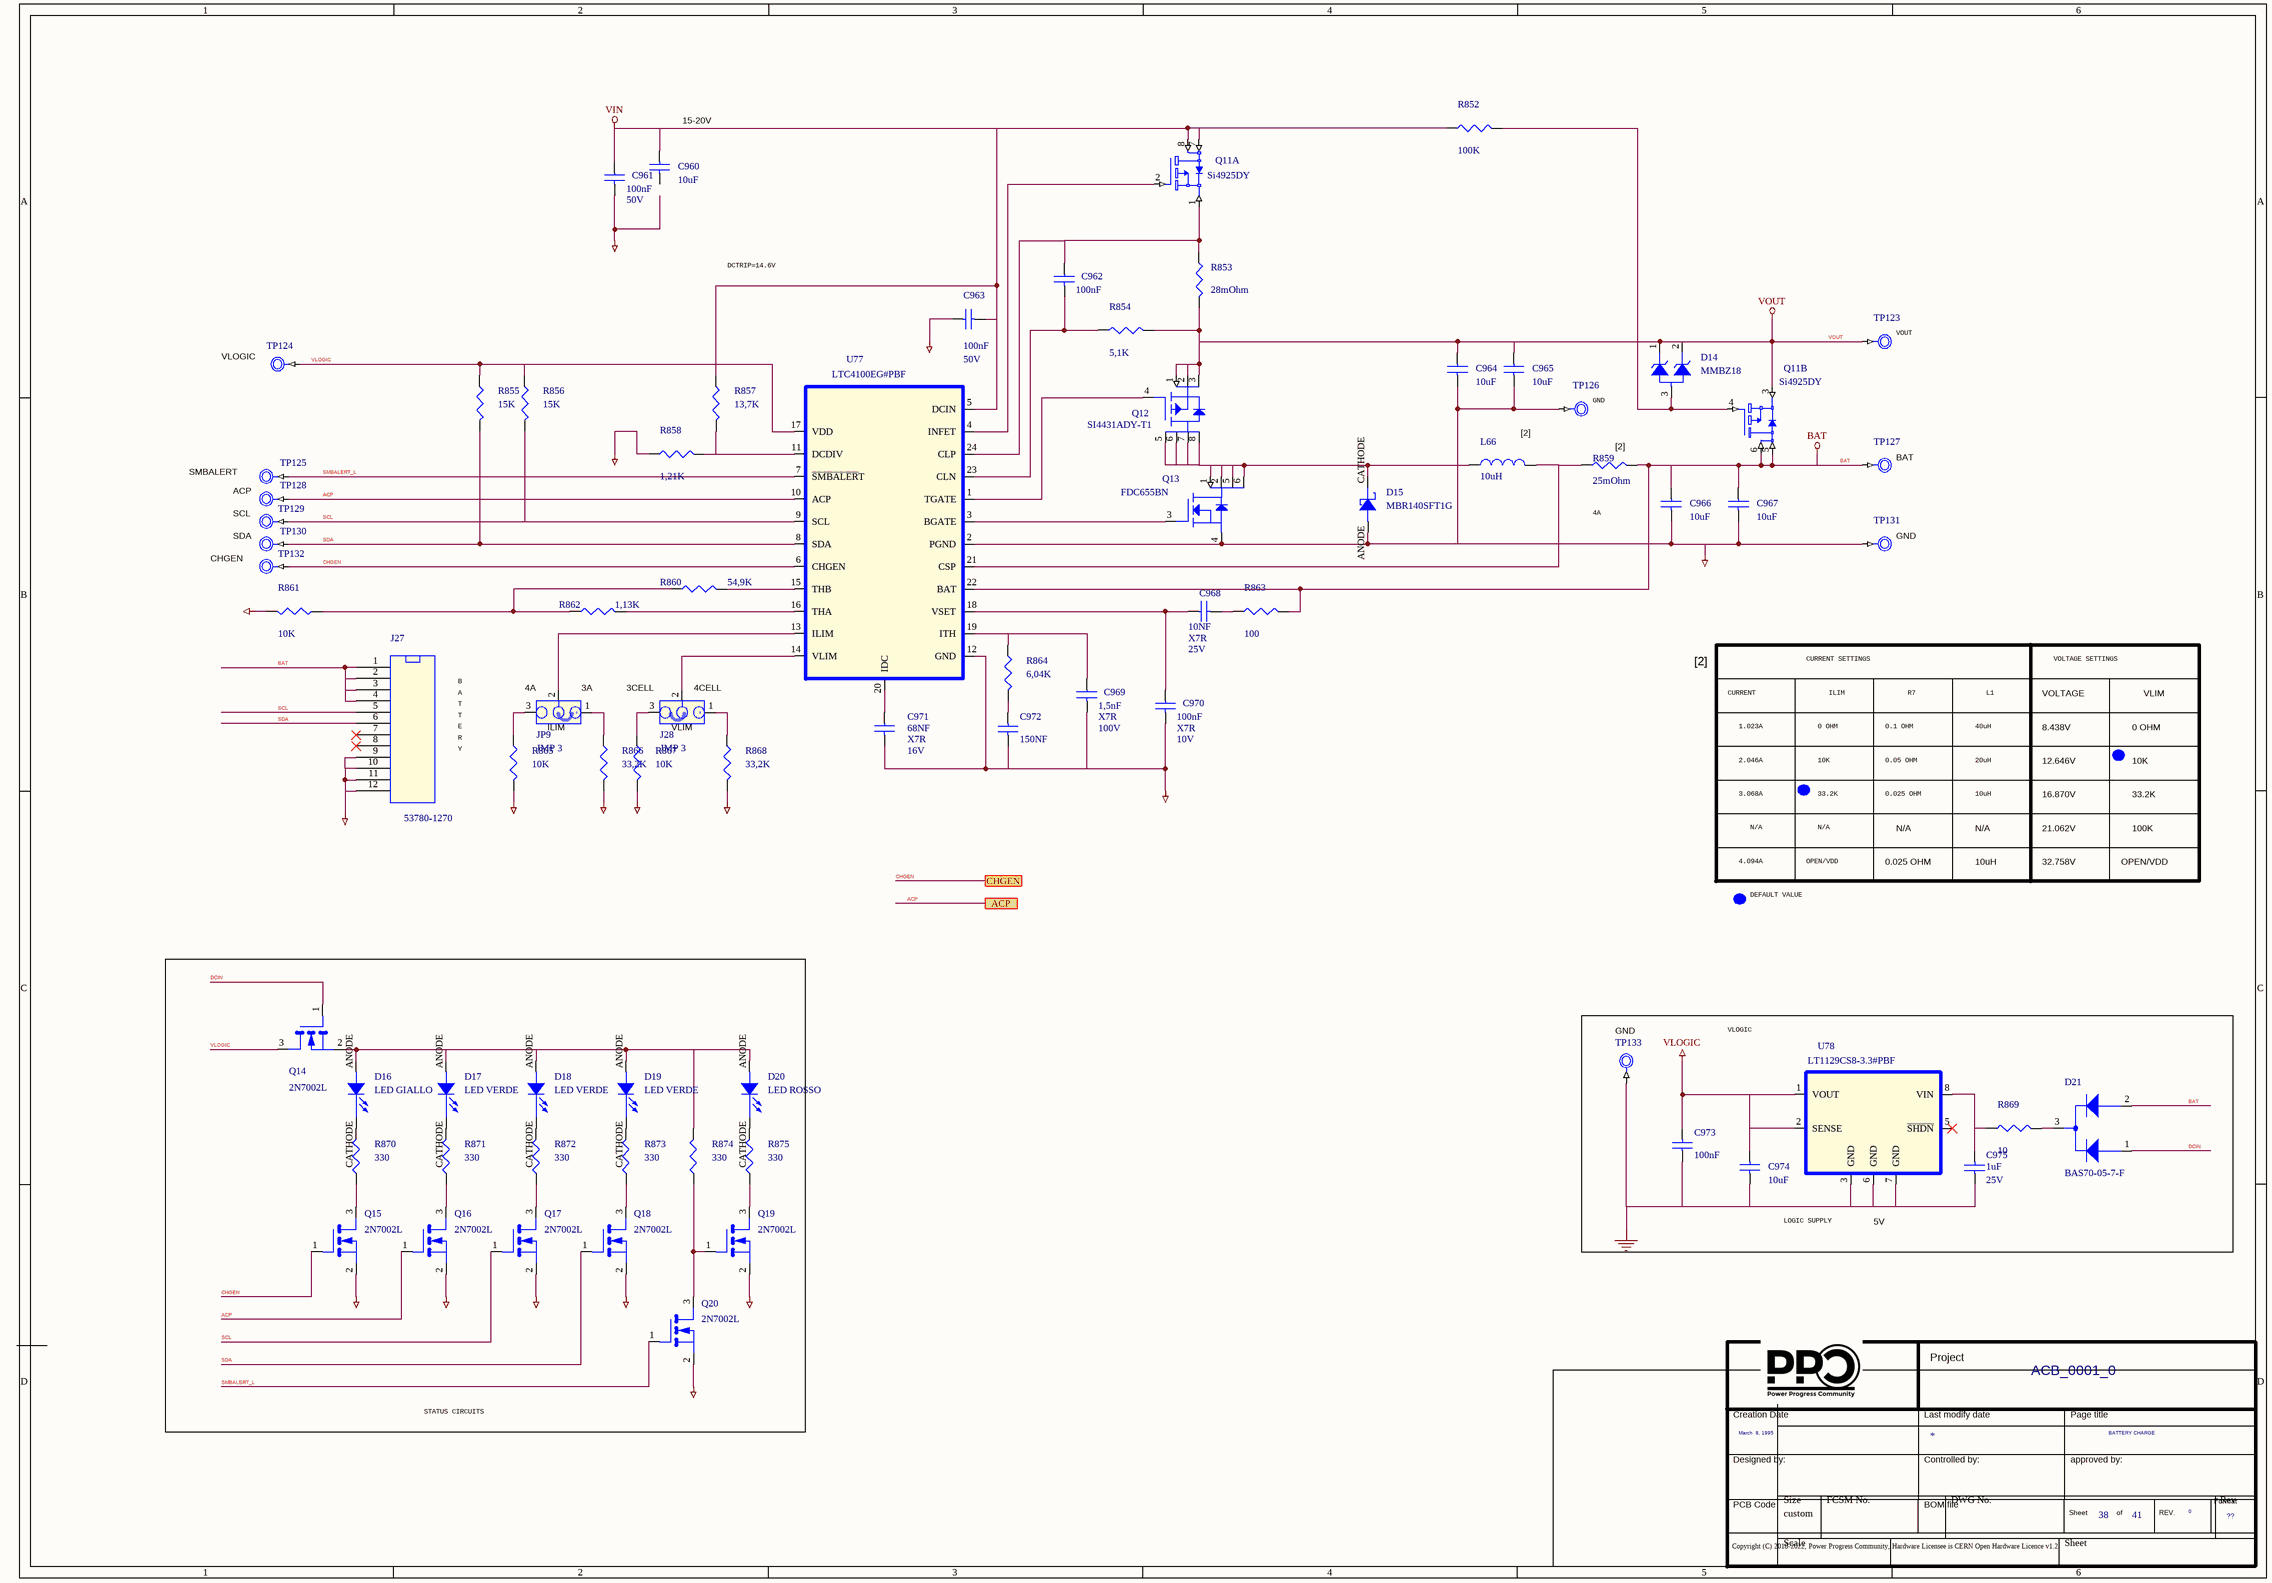
[diagram p64: 30C_battery_Charger.SchDoc]

### Parts
(Parts that share a designator on the sheet are numbered #1, #2 ... from top to bottom, then left to right.)
*#41  Page Count: 41  Page Create Date: March  8, 1995  Page Number: 38  Page Size: ??  Page Title: BATTERY CHARGE  RevCode: 0  Title: ACB_0001_0  (hidden comment: Title_block_PPC)  (graphical)
C960  10uF  [SMD_0603]
C961  100nF  Voltage: 50V  [SMD_0402]
C962  100nF  [SMD_0603]
C963  100nF  Voltage: 50V  [SMD_0402]
C964  10uF  [SMD_0603]
C965  10uF  [SMD_0603]
C966  10uF  [SMD_0603]
C967  10uF  [SMD_0603]
C968  10NF  Voltage: 25V  Tolerance: X7R  [SMD_0402]
C969  1,5nF  Tolerance: X7R  Voltage: 100V  [SMD_0402]
C970  100nF  Voltage: 10V  Tolerance: X7R  [SMD_0603]
C971  68NF  Voltage: 16V  Tolerance: X7R  [SMD_0402]
C972  150NF  [SMD_0402]
C973  100nF  [SMD_0603]
C974  10uF  [SMD_0603]
C975  1uF  Voltage: 25V  [SMD_0402]
D14  MMBZ18  [SOT_23]
D15  MBR140SFT1G  [sod123lf]
D16  LED GIALLO  [SMD_0603]
D17  LED VERDE  [SMD_0603]
D18  LED VERDE  [SMD_0603]
D19  LED VERDE  [SMD_0603]
D20  LED ROSSO  [SMD_0603]
D21  BAS70-05-7-F  [SOT-23]
J27  53780-1270  [SMD_2X50_P=0.635mm]
J28  JMP 3  [PTH]
JP9  JMP 3  [PTH]
L66  10uH  [SMD_10_2X10_5]
Q11  Si4925DY  [POWERPAK-SO-8/D]  (parts A,B of 2)
Q12  SI4431ADY-T1  [SOIC_8]
Q13  FDC655BN  [TSOT-23]
Q14  2N7002L  [SOT23]
Q15  2N7002L  [SOT23]
Q16  2N7002L  [SOT23]
Q17  2N7002L  [SOT23]
Q18  2N7002L  [SOT23]
Q19  2N7002L  [SOT23]
Q20  2N7002L  [SOT23]
R852  100K  [SMD_0402]
R853  28mOhm  [SMD_2512]
R854  5,1K  [SMD_0402]
R855  15K  [SMD_0402]
R856  15K  [SMD_0402]
R857  13,7K  [SMD_0402]
R858  1,21K  [SMD_0603]
R859  25mOhm  [SMD_2512]
R860  54,9K  [SMD_0603]
R861  10K  [SMD_0402]
R862  1,13K  [SMD_0402]
R863  100  [SMD_0402]
R864  6,04K  [SMD_0603]
R865  10K  [SMD_0603]
R866  33,2K  [SMD_0603]
R867  10K  [SMD_0402]
R868  33,2K  [SMD_0603]
R869  10  [SMD_0603]
R870  330  [SMD_0402]
R871  330  [SMD_0402]
R872  330  [SMD_0402]
R873  330  [SMD_0402]
R874  330  [SMD_0402]
R875  330  [SMD_0402]
TP123  Testpoint  [MILLMAX-2501-2]  (value not drawn)
TP124  Testpoint  [MILLMAX-2501-2]  (value not drawn)
TP125  Testpoint  [MILLMAX-2501-2]  (value not drawn)
TP126  Testpoint  [MILLMAX-2501-2]  (value not drawn)
TP127  Testpoint  [MILLMAX-2501-2]  (value not drawn)
TP128  Testpoint  [MILLMAX-2501-2]  (value not drawn)
TP129  Testpoint  [MILLMAX-2501-2]  (value not drawn)
TP130  Testpoint  [MILLMAX-2501-2]  (value not drawn)
TP131  Testpoint  [MILLMAX-2501-2]  (value not drawn)
TP132  Testpoint  [MILLMAX-2501-2]  (value not drawn)
TP133  mill-max-2308-2  [mill-max-2308]  (value not drawn)
U77  LTC4100EG#PBF  [SSOP-20GN]
U78  LT1129CS8-3.3#PBF  [SO-08]
XJP1  SHUNT  [NONE]  (value not drawn)
XJP2  SHUNT  [NONE]  (value not drawn)

### Blocks framed on the sheet
STATUS CIRCUITS: D16-D20 Q14-Q20 R870-R875

### Ports
ACP, CHGEN

### Nets
BAT: C966.1 C967.1 D21.2(C2) J27.1 J27.2 J27.3 J27.4 Q11.5(D) Q11.6(D) R859.2 R863.2 TP127.1 U77.22(BAT)
GND: C961.2 C963.1 C964.2 C965.2 C966.2 C967.2 C969.2 C970.2 C971.2 C972.2 C973.1 C974.2 C975.1 D15.ANODE J27.9 J27.10 J27.11 J27.12 Q13.4(SOURCE) Q15.2 Q16.2 Q17.2 Q18.2 Q19.2 Q20.2 R858.1 R861.2 R865.1 R866.2 R867.2 R868.2 TP126.1 TP131.1 TP133.1 U77.2(PGND) U77.12(GND) U78.3(GND) U78.6(GND) U78.7(GND)
VIN: C960.1 C961.1 C963.2 Q11.7(D) Q11.8(D) R852.1 R857.1 U77.5(DCIN)
VLOGIC: C973.2 C974.1 Q14.3 R855.1 R856.1 TP124.1 U77.17(VDD) U78.1(VOUT) U78.2(SENSE)
VOUT: C964.1 C965.1 D14.1(CATHODE1) D14.2(CATHODE2) Q11.3(S) Q12.1(S0) Q12.2(S1) Q12.3(S2) R853.2 R854.2 TP123.1
ACP: Q16.1 TP128.1 U77.10(ACP) ; port ACP
CHGEN: Q15.1 TP132.1 U77.6(CHGEN) ; port CHGEN
DCIN: D21.1(C1) Q14.1
SCL: J27.5 Q17.1 R856.2 TP129.1 U77.9(SCL)
SDA: J27.6 Q18.1 R855.2 TP130.1 U77.8(SDA)
SMBALERT_L: Q20.1 TP125.1 U77.7(~{SMBALER}T)
NetC962_1: C962.1 Q11.1(S) R853.1 U77.24(CLP)
NetC962_2: C962.2 R854.1 U77.23(CLN)
NetC968_1: C968.1 C970.1 U77.18(VSET)
NetC968_2: C968.2 R863.1
NetC969_1: C969.1 R864.1 U77.19(ITH)
NetC971_1: C971.1 U77.20(IDC)
NetC972_1: C972.1 R864.2
NetC975_2: C975.2 R869.1 U78.8(VIN)
NetD14_3: D14.3(ANODE) Q11.4(G) R852.2
NetD15_CATHODE: D15.CATHODE L66.1 Q12.5(D0) Q12.6(D1) Q12.7(D2) Q12.8(D4) Q13.1(DRAIN1) Q13.2(DRAIN2) Q13.5(DRAIN3) Q13.6(DRAIN4)
NetD16_ANODE: D16.ANODE D17.ANODE D18.ANODE D19.ANODE D20.ANODE Q14.2 R874.2
NetD16_CATHODE: D16.CATHODE R870.2
NetD17_CATHODE: D17.CATHODE R871.2
NetD18_CATHODE: D18.CATHODE R872.2
NetD19_CATHODE: D19.CATHODE R873.2
NetD20_CATHODE: D20.CATHODE R875.2
NetD21_3: D21.3(A) R869.2
NetJ28_1: J28.1 R868.1
NetJ28_2: J28.2 U77.14(VLIM)
NetJ28_3: J28.3 R867.1
NetJP9_1: JP9.1 R866.1
NetJP9_2: JP9.2 U77.13(ILIM)
NetJP9_3: JP9.3 R865.2
NetL66_2: L66.2 R859.1 U77.21(CSP)
NetQ11_2: Q11.2(G) U77.4(INFET)
NetQ12_4: Q12.4(G) U77.1(TGATE)
NetQ13_3: Q13.3(GATE) U77.3(BGATE)
NetQ15_3: Q15.3 R870.1
NetQ16_3: Q16.3 R871.1
NetQ17_3: Q17.3 R872.1
NetQ18_3: Q18.3 R873.1
NetQ19_1: Q19.1 Q20.3 R874.1
NetQ19_3: Q19.3 R875.1
NetR857_2: R857.2 R858.2 U77.11(DCDIV)
NetR860_1: R860.1 R861.1 R862.1
NetR860_2: R860.2 U77.15(THB)
NetR862_2: R862.2 U77.16(THA)

Not connected (* = marked no-connect by the designer): C960 2; J27 7* 8*; U78 5(~{SHDN})*

### Notes on the sheet
- (near C960) 15-20V
- DCTRIP=14.6V
- (near TP124) VLOGIC
- (near TP123) VOUT
- (near TP126) GND
- SMBALERT
- [2]
- (near R859) [2]
- (near TP127) BAT
- ACP
- SCL
- 4A
- CHGEN
- SDA
- (near TP131) GND
- B
- A
- (near JP9) 4A
- (near JP9) 3A
- (near J28) 3CELL
- (near J28) 4CELL
- CURRENT
- CURRENT SETTINGS
- ILIM
- R7
- L1
- VOLTAGE
- VOLTAGE SETTINGS
- VLIM
- T
- E
- R
- Y
- (near XJP2) VLIM
- 1.023A
- 0 OHM
- 0.1 OHM
- 40uH
- 8.438V
- 2.046A
- 3.068A
- 10K
- 33.2K
- 0.05 OHM
- 0.025 OHM
- 20uH
- 10uH
- 12.646V
- 16.870V
- 4.094A
- N/A
- OPEN/VDD
- 21.062V
- 32.758V
- 100K
- DEFAULT VALUE
- (near TP133) GND
- VLOGIC
- LOGIC SUPPLY
- 5V

### Library data of the parts
C960 C964-C967 C974 = CAP NP_Dup3: as C884 on sheet 29 Other Pwr 1; Part Type: Capacitors\Ceramic\SMD\0603; PCB Footprint: SMD_0603
C961 C963 = CAP NP_Dup9: COND.CER. 100NF 50V 0402 X7R SMD; Part Number: PASSIVE_24; Manufacturer 1: TDK; Manufacturer Part Number 1: CGA2B3X7R1H104M050BD; RSM: RC0402; Field1: 0805; Part Type: Capacitors\Ceramic\SMD\0402; Tolerance: X7R; PCB Footprint: SMD_0402
C962 C970 C973 = CAP NP_Dup9: COND.CER.100NF 25V 0603 X7R SMD; Manufacturer Part Number 1: PHY223891615649; Manufacturer 1: PHILIPS; Part Number: PASSIVE_117; RSM: RC0603; Field1: 0603; PCB Footprint: SMD_0603; Part Type: Capacitors\Ceramic\SMD\0603
  C962: Tolerance: X7R; Voltage: 25V
  C973: Voltage: 25V; Tolerance: X7R
C968 = CAP NP_Dup9: COND.CER. 10NF 50V 0402 X7R SMD; Part Number: PASSIVE_29; Manufacturer 1: KEMET; Manufacturer Part Number 1: C0402C103K5RACTU; Field1: 0603; RSM: RC0402; Part Type: Capacitors\Ceramic\SMD\0402; PCB Footprint: SMD_0402
C969 = CAP NP_Dup9: COND.CER. 1,5nF 50V 0402 X7R SMD; Manufacturer Part Number 1: 04022R152J9B20D; Manufacturer 1: YAGEO; Part Number: PASSIVE_16; RSM: RC0402; Field1: 0603; PCB Footprint: SMD_0402; Part Type: Capacitors\Ceramic\SMD\0402
C971 = CAP NP_Dup9: COND.CER. 68NF 50V 0402 X7R SMD; Manufacturer Part Number 1: GRM155R61C683KA01J; Manufacturer 1: Murata; Part Number: PASSIVE_101; RSM: RC0402; Field1: 0603; PCB Footprint: SMD_0402; Part Type: Capacitors\Ceramic\SMD\0402
C972 = CAP NP_Dup3: CAP CER 0.15UF 16V 10% X7R 0402; Manufacturer Part Number 1: C1005X7R1C154K050BC; Manufacturer 1: TDK; Part Number: PASSIVE_38; RSM: RC0402; PCB Footprint: SMD_0402; Part Type: Capacitors\Ceramic\SMD\0402
C975 = CAP NP_Dup9: CAP CER 1UF 25V X6S 0402; Part Number: PASSIVE_1446; Manufacturer 1: Murata; Manufacturer Part Number 1: GRM155C81E105KE11D; Field1: 0603; Tolerance: X7R; RSM: RC0402; Part Type: Capacitors\Ceramic\SMD\0402; PCB Footprint: SMD_0402
D14 = DIODO_ZENER_SOT23_DOPPIO: DIODO, TVS ZENER DUAL, 18V, 40W, SOT23; Part Number: DISCRETE_131; Manufacturer 1: Motorola; Manufacturer Part Number 1: MMBZ18VALT1G; RSM: SOT-23; PCB Footprint: SOT_23; Part Type: Diodes\ZENER; Distributor 1: DIGIKEY(MMBZ18VALT1GOSCT-ND)
D15 = diode_schottky_A1C2_0: DIODE SCH PWR RECT 1A 40V SOD123; Manufacturer 1: ON SEMICONDUCTOR; Part Number: DISCRETE_95; RSM: SOD123-F-AK-NXP; PCB Footprint: sod123lf; Distributor 1: DIGIKEY(MBR140SFT1GOSTR-ND); Manufacturer Part Number 1: MBR140SFT1G; Part Type: Diodes\SCHOTTKY
D16 = LED_0: LED CHIPLED GIALLO 160Deg 6.5mcd; Manufacturer Part Number 1: TLMY1000-GS08; Manufacturer 1: Vishay; Part Number: DISCRETE_24; RSM: LED0603-AK; PCB Footprint: SMD_0603; Distributor 1: MOUSER(78-TLMY1000); Part Type: Diodes\LED
D17-D19 = LED_0: LED CHIPLED VERDE 40mcd 570nm; Manufacturer Part Number 1: 598-8070-107F; Manufacturer 1: DIALIGHT; Part Number: DISCRETE_31; RSM: LED0603-AK; PCB Footprint: SMD_0603; Distributor 1: MOUSER(645-598-8070-107F); Part Type: Diodes\LED
D20 = LED_0: LED CHIPLED ROSSO; Manufacturer Part Number 1: APT1608SRCPRV; Manufacturer 1: KINGBRIGHT; Part Number: DISCRETE_30; RSM: LED0603-AK; PCB Footprint: SMD_0603; Distributor 1: MOUSER(604-APT1608SRCPRV); Part Type: Diodes\LED
D21 = BAT54C: DIODE SCHOTTKY 70V 70MA SOT23; Manufacturer 1: DIODES; Part Number: DISCRETE_82; Distributor 1: DIGIKEY(BAS70-05FDICT-ND); Manufacturer Part Number 1: BAS70-05-7-F; Part Type: Diodes\SCHOTTKY; PCB Footprint: SOT-23; RSM: SOT-23
J27 = HEADER_12X1: Terminali e capicorda 1.25 WtB ssy 12Ckt; PART NUMBER: CONNECTORS_686; Manufacturer 1: MOLEX; PCB Footprint: 1X12 1.25mm smd; RSM: MOLEX-53780-12; Part Type: B2W; Manufacturer Part Number 1: 53780-1270; Distributor 1: MOUSER(538-53780-1270)
J28 JP9 = JUMPER_3: STRIP MASC.1x3P CS.p=2.54mm; Part Number: CONNECTORS_449; Manufacturer 1: Samtec; Manufacturer Part Number 1: TLW-103-05-G-S; RSM: PIN-100MLS-3; PCB Footprint: PTH; Part Type: Strip\Terminal; Distributor 1: FARNELL(1668490)
L66 = INDUCTOR_Dup1: Induttori fissi WE-HCI Flat 1050 10uH 7.2A; Manufacturer Part Number 1: 7443251000; Manufacturer 1: WURTH; Part Number: PASSIVE_1470; RSM: IND-WE-7443251000; Part Type: Inductors\SMD; PCB Footprint: SMD_10_2X10_5
Q11 = SI7941DP: Trans MOSFET P-CH 30V 5.3A 8-Pin SOIC; 7th Part Field: Dual P-Chan.,; 4th Part Field: Siliconix; Part Number: DISCRETE_320; Manufacturer 1: ON SEMICONDUCTOR; Manufacturer Part Number 1: SI4431ADY-T1; PCB Footprint: SOIC_8; RSM: SO-8; Part Type: Mosfet\HIGH_SIDE; Distributor 1: ARROW (SI4431ADY-T1)
Q12 = Si4431ADY: Trans MOSFET P-CH 30V 5.3A 8-Pin SOIC; Part Number: DISCRETE_319; Manufacturer 1: Vishay; RSM: SO-8; Part Type: Mosfet\HIGH_SIDE; PCB Footprint: SOIC_8; Manufacturer Part Number 1: SI4431ADY-T1; Distributor 1: ARROEW (FDC645N)
Q13 = FDC645N: MOSFET N-CH 30V 6.3A 6-Pin TSOT-23; Part Number: DISCRETE_318; Manufacturer 1: ON Semi; RSM: TSOT-6; Part Type: Mosfet\HIGH_SIDE; PCB Footprint: TSOT-23; Manufacturer Part Number 1: FDC655BN; Distributor 1: ARROW (FDC655BN)
Q14-Q20 = 2N7002: TRAN NMOS 60V 115MA SOT23; Part Number: DISCRETE_188; Manufacturer 1: ON SEMICONDUCTORS; Manufacturer Part Number 1: 2N7002LT1G; RSM: SOT-23; PCB Footprint: sot23; Part Type: Mosfet\SOT23; Distributor 1: DIGIKEY(2N7002LT3GOSCT-ND)
R852 = R_Dup6: as R837 on sheet 30A Other Pwr 2; Part Type: Resistors\Fixed\SMD\0402\5%; PCB Footprint: SMD_0402; Manufacturer Part Number 1: RESIS.CHIP 100K 5% 0402 SMD
R853 = R_Dup6: Current Sense Resistors - SMD 0.028 Ohm 1% 1W; Manufacturer Part Number 1: WSL2512R0280FEA18; Manufacturer 1: Vishay; Part Number: PASSIVE_1465; RSM: RC2512; PCB Footprint: SMD_2512; Part Type: Resistors\Fixed\SMD\Current Sense
R854 = R_Dup6: RES SMD 5.1K OHM 1% 1/16W 0402; Manufacturer Part Number 1: RC0402FR-075K1L; Manufacturer 1: YAGEO; Part Number: PASSIVE_742; RSM: RC0402; PCB Footprint: SMD_0402; Part Type: Resistors\Fixed\SMD\0402\1%
R855 R856 = R_Dup6: RESIS.CHIP 15K 1% 0402 SMD; Part Number: PASSIVE_614; Manufacturer 1: ROYAL OHM; RSM: RC0402; Part Type: Resistors\Fixed\SMD\0402\1%; PCB Footprint: SMD_0402; Manufacturer Part Number 1: RESIS.CHIP 15K 1% 0402 SMD
R857 = R_Dup6: RESIS.CHIP 13,7K 1% 0402 SMD; Part Number: PASSIVE_600; Manufacturer 1: PANASONIC; Manufacturer Part Number 1: ERJ-2RKF1372X; RSM: RC0402; Part Type: Resistors\Fixed\SMD\0402\1%; PCB Footprint: SMD_0402
R858 = R_Dup6: RESIS.CHIP 1,21K 1% 0603 SMD; Manufacturer Part Number 1: RES.1K21 1% 0603 SMD; Manufacturer 1: ROYAL OHM; Part Number: PASSIVE_884; RSM: RC0603; PCB Footprint: SMD_0603; Part Type: Resistors\Fixed\SMD\0603\1%
R859 = R_Dup6: Current Sense Resistors - SMD 0.025 Ohm 1% 1W; Part Number: PASSIVE_1466; Manufacturer 1: Vishay; Manufacturer Part Number 1: WSL2512R0250FEA18; RSM: RC2512; PCB Footprint: SMD_2512; Part Type: Resistors\Fixed\SMD\Current Sense
R860 = R_Dup6: RESIS.CHIP 54,9K 1% 0603 SMD E96; Part Number: PASSIVE_1041; Manufacturer 1: ROYAL OHM; Manufacturer Part Number 1: CHIP RES.54K9 0603 1%; RSM: RC0603; PCB Footprint: SMD_0603; Part Type: Resistors\Fixed\SMD\0603\1%
R861 R867 = R_Dup6: as R839 on sheet 30A Other Pwr 2; Part Type: Resistors\Fixed\SMD\0402\1%; PCB Footprint: SMD_0402; Manufacturer Part Number 1: RESIS.CHIP 10K 1% 0402 SMD
R862 = R_Dup6: RESIS.CHIP 1,13K 1% 0402 SMD; Manufacturer Part Number 1: RC0402FR-071K13L; Manufacturer 1: YAGEO; Part Number: PASSIVE_569; RSM: RC0402; PCB Footprint: SMD_0402; Part Type: Resistors\Fixed\SMD\0402\1%
R863 = R_Dup6: RESIS.CHIP 100R 5% 0402 SMD; Part Number: PASSIVE_812; Manufacturer 1: ROYAL OHM; RSM: RC0402; Part Type: Resistors\Fixed\SMD\0402\5%; PCB Footprint: SMD_0402; Manufacturer Part Number 1: RESIS.CHIP 100R 5% 0402 SMD
R864 = R_Dup6: RESIS.CHIP 6K04 1% 0603 SMD; Manufacturer 1: ROYAL OHM; Part Number: PASSIVE_1047; RSM: RC0603; Manufacturer Part Number 1: RESIS.CHIP 6K04 1% 0603 SMD; PCB Footprint: SMD_0603; Part Type: Resistors\Fixed\SMD\0603\1%
R865 = R_Dup6: RESIS.CHIP 10K 1% 0603 SMD; Manufacturer Part Number 1: RES.10K 0603 1% SMD; Manufacturer 1: ROYAL OHM; Part Number: PASSIVE_900; RSM: RC0603; PCB Footprint: SMD_0603; Part Type: Resistors\Fixed\SMD\0603\1%
R866 R868 = R_Dup6: RESIS.CHIP 33K2 1% 0603 SMD; Part Number: PASSIVE_988; Manufacturer 1: ROYAL OHM; RSM: RC0603; Part Type: Resistors\Fixed\SMD\0603\1%; PCB Footprint: SMD_0603; Manufacturer Part Number 1: RESIS.CHIP 33K2 1% 0603 SMD
R869 = R_Dup6: RESIS.CHIP 10R 1% 0603 SMD; Manufacturer 1: ROYAL OHM; Part Number: PASSIVE_896; RSM: RC0603; Manufacturer Part Number 1: RESIS.CHIP 10R 1% 0603 SMD; PCB Footprint: SMD_0603; Part Type: Resistors\Fixed\SMD\0603\1%
R870-R875 = R_Dup6: RESIS.CHIP 330R 5% 0402 SMD; Manufacturer 1: ROYAL OHM; Part Number: PASSIVE_854; RSM: RC0402; Manufacturer Part Number 1: RESIS.CHIP 330R 5% 0402 SMD; PCB Footprint: SMD_0402; Part Type: Resistors\Fixed\SMD\0402\5%
TP123-TP132 = MillMax-2501-2: TURRET; 5th Part Field: 2501-2; 7th Part Field: Turret,; Part Number: MILL-MAX 2308-2; PCB Footprint: MM/2308; RSM: AE-TESTPOINT; 4th Part Field: Mill Max
TP133 = mill-max-2308-2: TURRET; 5th Part Field: 2308-2; 7th Part Field: Testpoint,; Part Number: MILL-MAX 2308-2; PCB Footprint: MM/2308; RSM: AE-TESTPOINT; 4th Part Field: Mill-Max
U77 = LTC4008EGN_3: IC SMART BATTERY CHARGER 24-SSOP; Part Number: LINEAR_335; Manufacturer 1: ANALOG; Manufacturer Part Number 1: LTC4100EG#PBF / LTC4100EG#PBF; RSM: SSOP-24; Part Type: Regulators\battcharge; PCB Footprint: 24-SSOP; Distributor 1: DIGIKEY(LTC4100EG#PBF-ND)
U78 = LT1129CS8_0: IC REG LINEAR 3.3V 700MA 8SOIC; Manufacturer 1: ANALOG; Part Number: LINEAR_336; 7TH_PART_FIELD: I.C.; RSM: SO-8; PCB Footprint: SOIC8; 2ND PART FIELD: SO-08; Distributor 1: DIGIKEY(LT1129CS8-3.3#PBF-ND); Manufacturer Part Number 1: LT1129CS8-3.3#PBF; Part Type: Regulators\LDO; 4TH_PART_FIELD: LINEAR; 5TH_PART_FIELD: LT1129CS8-3.3
XJP1 XJP2 = SHUNT_0: Part Number: SAMTEC 2SN-BK-G; PCB Footprint: none
*#41 = Title_block_PPC: Page Modify Date: *